# EAGLE schematic Yocto v2.007 (EAGLE 6.1), part 1 of 3

## Sheet 1 of 18: SEQ
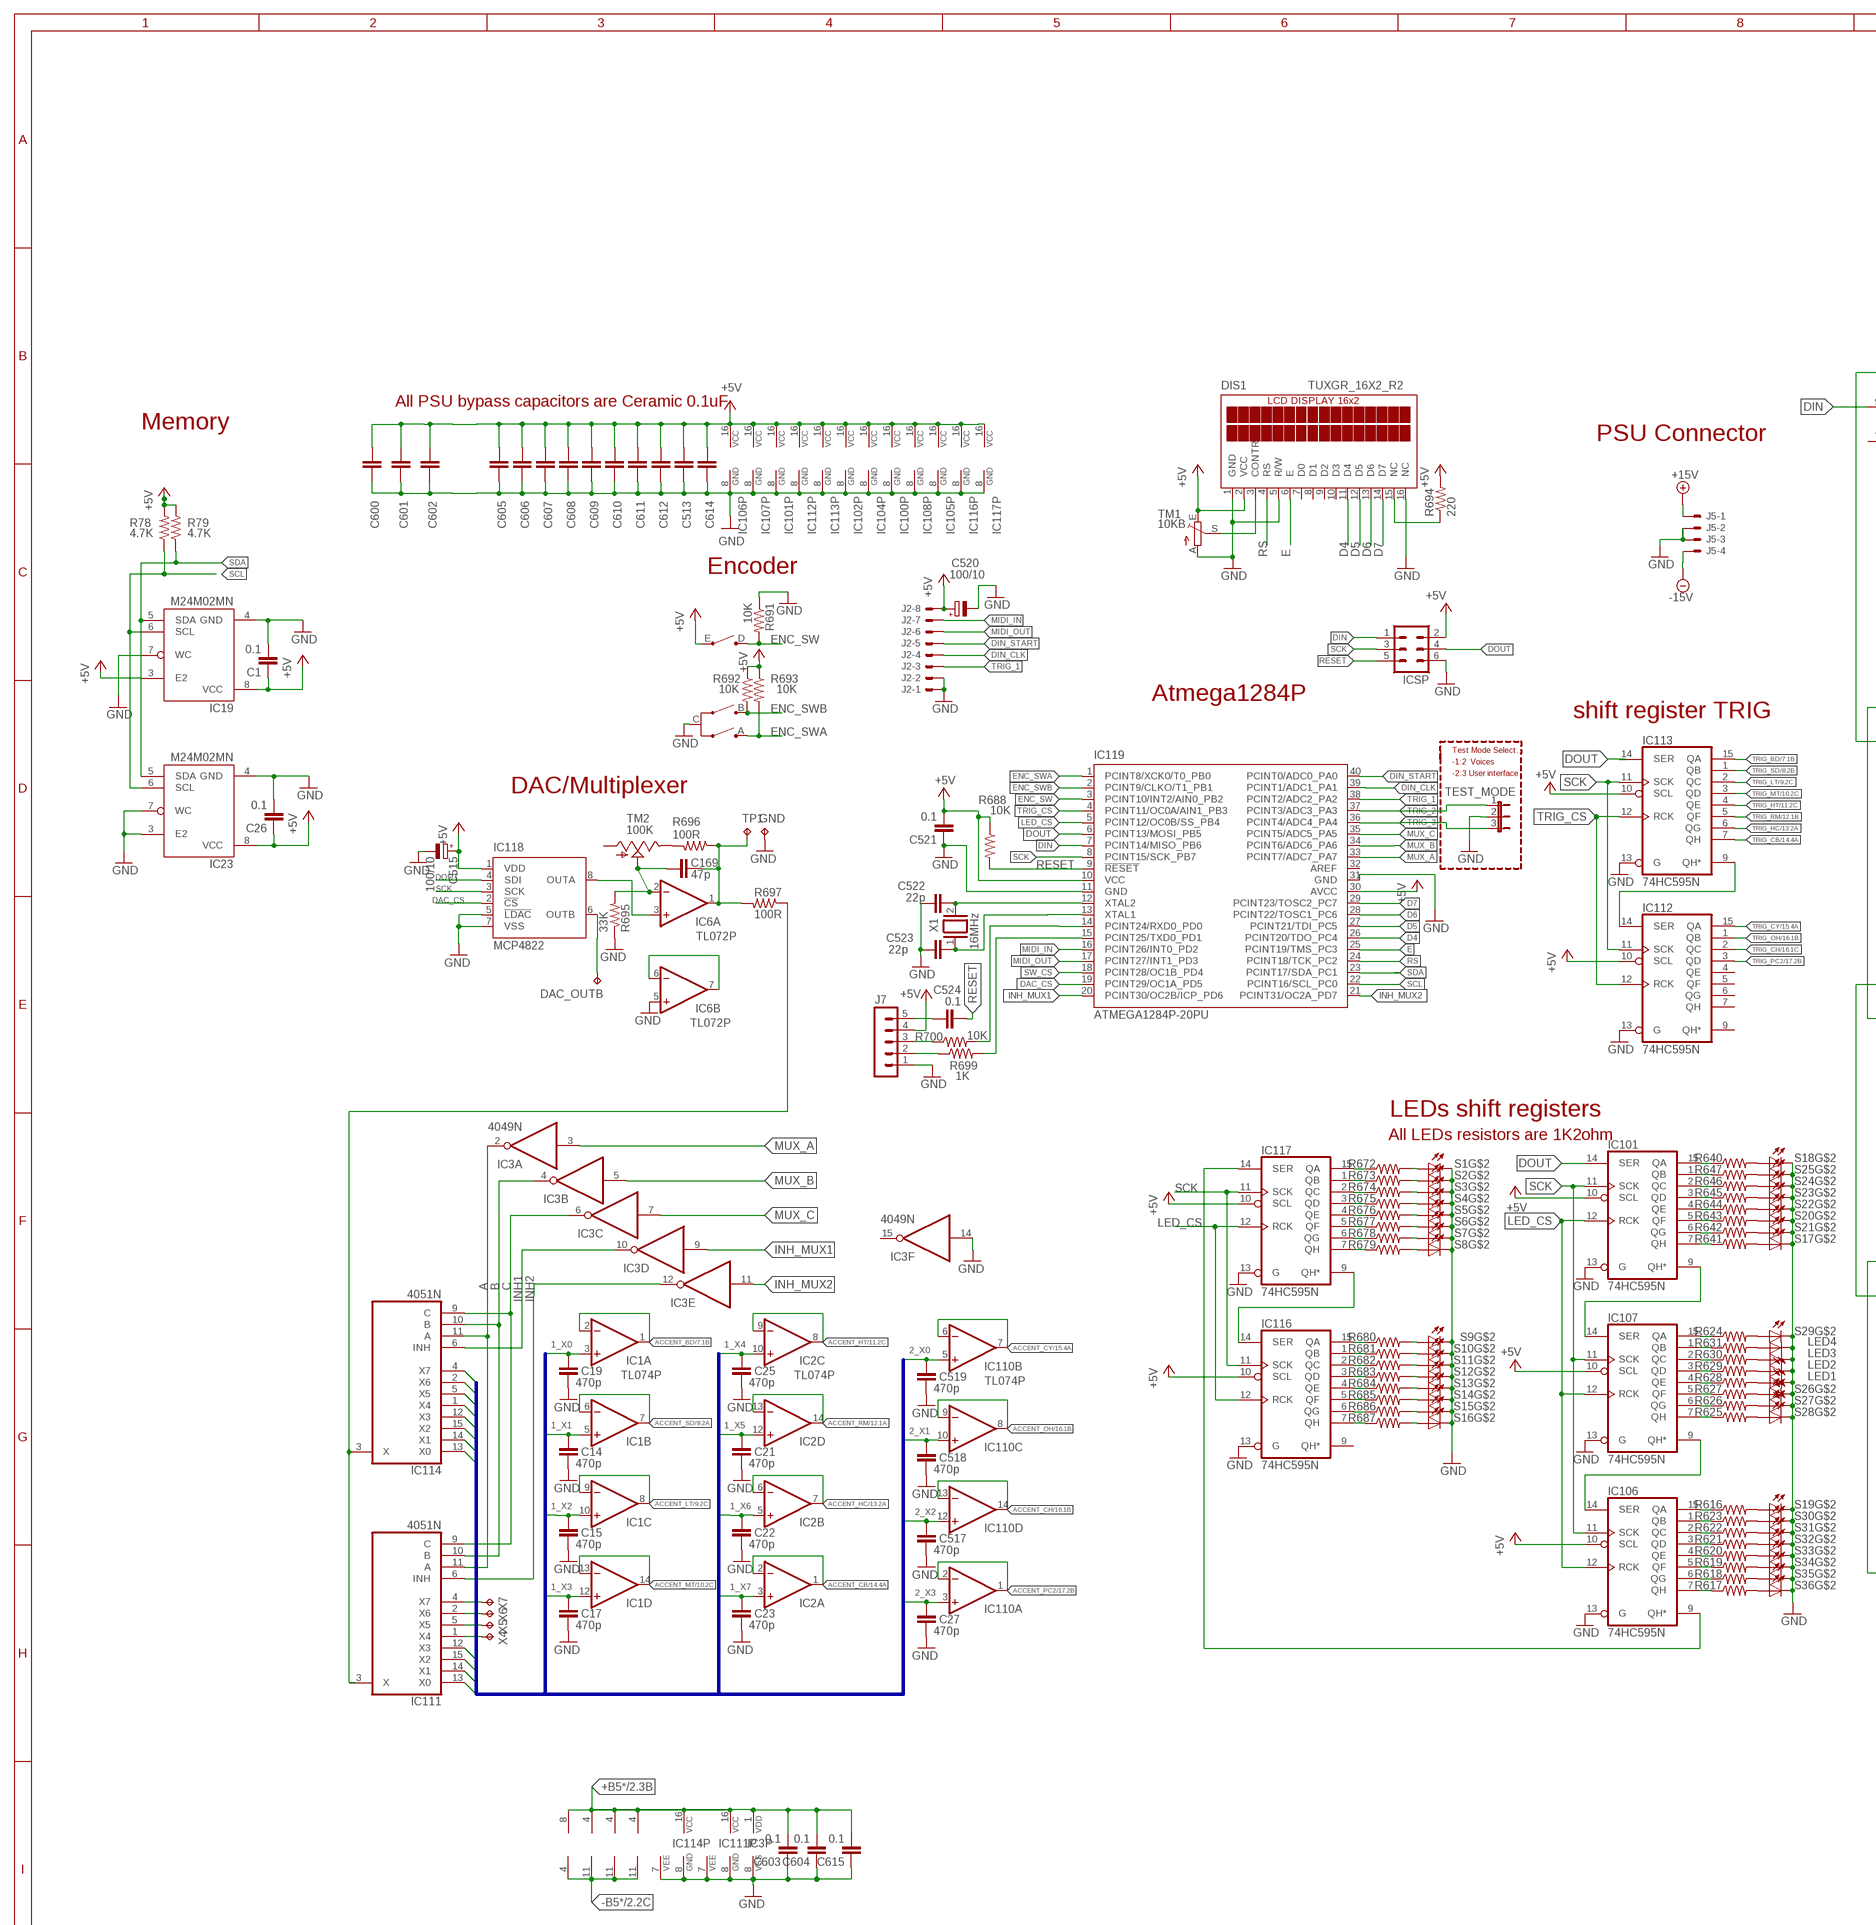
[diagram p0: schematic, sheet 1, part 1 of 2]
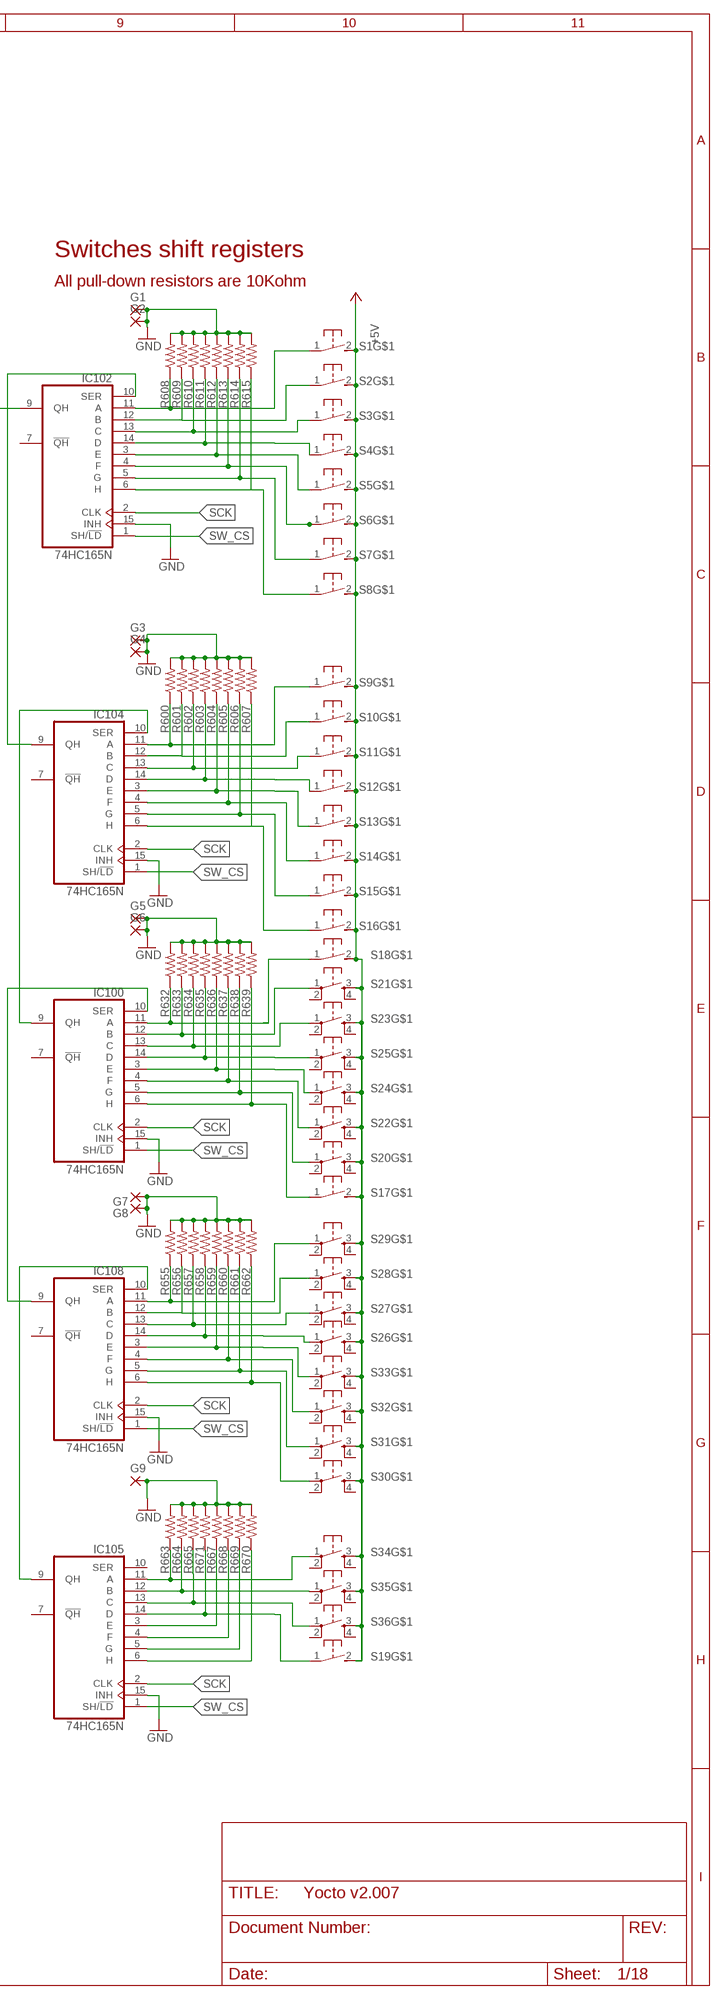
[diagram p1: schematic, sheet 1, part 2 of 2]

### Parts
C1  0.1  C-EU050-024X044  [C050-024X044]
C14  470p  C-EU050-025X075  [C050-025X075]
C15  470p  C-EU050-025X075  [C050-025X075]
C17  470p  C-EU050-025X075  [C050-025X075]
C19  470p  C-EU050-025X075  [C050-025X075]
C21  470p  C-EU050-025X075  [C050-025X075]
C22  470p  C-EU050-025X075  [C050-025X075]
C23  470p  C-EU050-025X075  [C050-025X075]
C25  470p  C-EU050-025X075  [C050-025X075]
C26  0.1  C-EU050-024X044  [C050-024X044]
C27  470p  C-EU050-025X075  [C050-025X075]
C169  47p  C-EU025-025X050  [C025-025X050]
C513  0.1  C-EU050-024X044  [C050-024X044]
C515  100/10  CPOL-EUE2-5  [E2-5]
C517  470p  C-EU050-025X075  [C050-025X075]
C518  470p  C-EU050-025X075  [C050-025X075]
C519  470p  C-EU050-025X075  [C050-025X075]
C520  100/10  CPOL-EUE2-5  [E2-5]
C521  0.1  C-EU050-024X044  [C050-024X044]
C522  22p  C-EU025-025X050  [C025-025X050]
C523  22p  C-EU025-025X050  [C025-025X050]
C524  0.1  C-EU050-024X044  [C050-024X044]
C600  0.1  C-EU050-024X044  [C050-024X044]
C601  0.1  C-EU050-024X044  [C050-024X044]
C602  0.1  C-EU050-024X044  [C050-024X044]
C603  0.1  C-EU050-024X044  [C050-024X044]
C604  0.1  C-EU050-024X044  [C050-024X044]
C605  0.1  C-EU050-024X044  [C050-024X044]
C606  0.1  C-EU050-024X044  [C050-024X044]
C607  0.1  C-EU050-024X044  [C050-024X044]
C608  0.1  C-EU050-024X044  [C050-024X044]
C609  0.1  C-EU050-024X044  [C050-024X044]
C610  0.1  C-EU050-024X044  [C050-024X044]
C611  0.1  C-EU050-024X044  [C050-024X044]
C612  0.1  C-EU050-024X044  [C050-024X044]
C614  0.1  C-EU050-024X044  [C050-024X044]
C615  0.1  C-EU050-024X044  [C050-024X044]
DAC_OUTB  TPB0,8  [B0,8]
DIS1  TUXGR_16X2_R2  [TUXGR_16X2_R2]
G1  WIREPAD1,6/0,8  [1,6/0,8]
G2  WIREPAD1,6/0,8  [1,6/0,8]
G3  WIREPAD1,6/0,8  [1,6/0,8]
G4  WIREPAD1,6/0,8  [1,6/0,8]
G5  WIREPAD1,6/0,8  [1,6/0,8]
G6  WIREPAD1,6/0,8  [1,6/0,8]
G7  WIREPAD1,6/0,8  [1,6/0,8]
G8  WIREPAD1,6/0,8  [1,6/0,8]
G9  WIREPAD1,6/0,8  [1,6/0,8]
GND  TPB0,8  [B0,8]
IC1  TL074P  [DIL14]
IC2  TL074P  [DIL14]
IC3  4049N  [DIL16]
IC6  TL072P  [DIL08]
IC19  M24M02MN  [SO08]
IC23  M24M02MN  [SO08]
IC100  74HC165N  [DIL16]
IC101  74HC595N  [DIL16]
IC102  74HC165N  [DIL16]
IC104  74HC165N  [DIL16]
IC105  74HC165N  [DIL16]
IC106  74HC595N  [DIL16]
IC107  74HC595N  [DIL16]
IC108  74HC165N  [DIL16]
IC110  TL074P  [DIL14]
IC111  4051N  [DIL16]
IC112  74HC595N  [DIL16]
IC113  74HC595N  [DIL16]
IC114  4051N  [DIL16]
IC116  74HC595N  [DIL16]
IC117  74HC595N  [DIL16]
IC118  MCP4822  [DIL8]
IC119  ATMEGA1284P-20PU  ATMEGA644-20PU  [DIL40]
ICSP  MA03-2  [MA03-2]
J2  22-27-2081-08  [6410-08]
J5  KK-156-4  [KK-156-4]
J7  MA05-1  [MA05-1A]
LED1  LED3MM  [LED3MM]
LED2  LED3MM  [LED3MM]
LED3  LED3MM  [LED3MM]
LED4  LED3MM  [LED3MM]
R78  4.7K  R-US_0207/7  [0207/7]
R79  4.7K  R-US_0207/7  [0207/7]
R600  10K  R-US_0207/7  [0207/7]
R601  10K  R-US_0207/7  [0207/7]
R602  10K  R-US_0207/7  [0207/7]
R603  10K  R-US_0207/7  [0207/7]
R604  10K  R-US_0207/7  [0207/7]
R605  10K  R-US_0207/7  [0207/7]
R606  10K  R-US_0207/7  [0207/7]
R607  10K  R-US_0207/7  [0207/7]
R608  10K  R-US_0207/7  [0207/7]
R609  10K  R-US_0207/7  [0207/7]
R610  10K  R-US_0207/7  [0207/7]
R611  10K  R-US_0207/7  [0207/7]
R612  10K  R-US_0207/7  [0207/7]
R613  10K  R-US_0207/7  [0207/7]
R614  10K  R-US_0207/7  [0207/7]
R615  10K  R-US_0207/7  [0207/7]
R616  1.2K  R-US_0207/7  [0207/7]
R617  1.2K  R-US_0207/7  [0207/7]
R618  1.2K  R-US_0207/7  [0207/7]
R619  1.2K  R-US_0207/7  [0207/7]
R620  1.2K  R-US_0207/7  [0207/7]
R621  1.2K  R-US_0207/7  [0207/7]
R622  1.2K  R-US_0207/7  [0207/7]
R623  1.2K  R-US_0207/7  [0207/7]
R624  1.2K  R-US_0207/7  [0207/7]
R625  1.2K  R-US_0207/7  [0207/7]
R626  1.2K  R-US_0207/7  [0207/7]
R627  1.2K  R-US_0207/7  [0207/7]
R628  1.2K  R-US_0207/7  [0207/7]
R629  1.2K  R-US_0207/7  [0207/7]
R630  1.2K  R-US_0207/7  [0207/7]
R631  1.2K  R-US_0207/7  [0207/7]
R632  10K  R-US_0207/7  [0207/7]
R633  10K  R-US_0207/7  [0207/7]
R634  10K  R-US_0207/7  [0207/7]
R635  10K  R-US_0207/7  [0207/7]
R636  10K  R-US_0207/7  [0207/7]
R637  10K  R-US_0207/7  [0207/7]
R638  10K  R-US_0207/7  [0207/7]
R639  10K  R-US_0207/7  [0207/7]
R640  1.2K  R-US_0207/7  [0207/7]
R641  1.2K  R-US_0207/7  [0207/7]
R642  1.2K  R-US_0207/7  [0207/7]
R643  1.2K  R-US_0207/7  [0207/7]
R644  1.2K  R-US_0207/7  [0207/7]
R645  1.2K  R-US_0207/7  [0207/7]
R646  1.2K  R-US_0207/7  [0207/7]
R647  1.2K  R-US_0207/7  [0207/7]
R655  10K  R-US_0207/7  [0207/7]
R656  10K  R-US_0207/7  [0207/7]
R657  10K  R-US_0207/7  [0207/7]
R658  10K  R-US_0207/7  [0207/7]
R659  10K  R-US_0207/7  [0207/7]
R660  10K  R-US_0207/7  [0207/7]
R661  10K  R-US_0207/7  [0207/7]
R662  10K  R-US_0207/7  [0207/7]
R663  10K  R-US_0207/7  [0207/7]
R664  10K  R-US_0207/7  [0207/7]
R665  10K  R-US_0207/7  [0207/7]
R667  10K  R-US_0207/7  [0207/7]
R668  10K  R-US_0207/7  [0207/7]
R669  10K  R-US_0207/7  [0207/7]
R670  10K  R-US_0207/7  [0207/7]
R671  10K  R-US_0207/7  [0207/7]
R672  1.2K  R-US_0207/7  [0207/7]
R673  1.2K  R-US_0207/7  [0207/7]
R674  1.2K  R-US_0207/7  [0207/7]
R675  1.2K  R-US_0207/7  [0207/7]
R676  1.2K  R-US_0207/7  [0207/7]
R677  1.2K  R-US_0207/7  [0207/7]
R678  1.2K  R-US_0207/7  [0207/7]
R679  1.2K  R-US_0207/7  [0207/7]
R680  1.2K  R-US_0207/7  [0207/7]
R681  1.2K  R-US_0207/7  [0207/7]
R682  1.2K  R-US_0207/7  [0207/7]
R683  1.2K  R-US_0207/7  [0207/7]
R684  1.2K  R-US_0207/7  [0207/7]
R685  1.2K  R-US_0207/7  [0207/7]
R686  1.2K  R-US_0207/7  [0207/7]
R687  1.2K  R-US_0207/7  [0207/7]
R688  10K  R-US_0207/7  [0207/7]
R691  10K  R-US_0207/7  [0207/7]
R692  10K  R-US_0207/7  [0207/7]
R693  10K  R-US_0207/7  [0207/7]
R694  220  R-US_0207/7  [0207/7]
R695  33K  R-US_0207/7  [0207/7]
R696  100R  R-US_0207/7  [0207/7]
R697  100R  R-US_0207/7  [0207/7]
R699  1K  R-US_0207/7  [0207/7]
R700  10K  R-US_0207/7  [0207/7]
S1  MX1A_CHERRY_SW_LED"  [MX1A-SW]
S2  MX1A_CHERRY_SW_LED"  [MX1A-SW]
S3  MX1A_CHERRY_SW_LED"  [MX1A-SW]
S4  MX1A_CHERRY_SW_LED"  [MX1A-SW]
S5  MX1A_CHERRY_SW_LED"  [MX1A-SW]
S6  MX1A_CHERRY_SW_LED"  [MX1A-SW]
S7  MX1A_CHERRY_SW_LED"  [MX1A-SW]
S8  MX1A_CHERRY_SW_LED"  [MX1A-SW]
S9  MX1A_CHERRY_SW_LED"  [MX1A-SW]
S10  MX1A_CHERRY_SW_LED"  [MX1A-SW]
S11  MX1A_CHERRY_SW_LED"  [MX1A-SW]
S12  MX1A_CHERRY_SW_LED"  [MX1A-SW]
S13  MX1A_CHERRY_SW_LED"  [MX1A-SW]
S14  MX1A_CHERRY_SW_LED"  [MX1A-SW]
S15  MX1A_CHERRY_SW_LED"  [MX1A-SW]
S16  MX1A_CHERRY_SW_LED"  [MX1A-SW]
S17  MX1A_CHERRY_SW_LED"  [MX1A-SW]
S18  MX1A_CHERRY_SW_LED"  [MX1A-SW]
S19  MX1A_CHERRY_SW_LED"  [MX1A-SW]
S20  ZTSN_SW_LED"  [SPH_SW]
S21  ZTSN_SW_LED"  [SPH_SW]
S22  ZTSN_SW_LED"  [SPH_SW]
S23  ZTSN_SW_LED"  [SPH_SW]
S24  ZTSN_SW_LED"  [SPH_SW]
S25  ZTSN_SW_LED"  [SPH_SW]
S26  ZTSN_SW_LED"  [SPH_SW]
S27  ZTSN_SW_LED"  [SPH_SW]
S28  ZTSN_SW_LED"  [SPH_SW]
S29  ZTSN_SW_LED"  [SPH_SW]
S30  ZTSN_SW_LED"  [SPH_SW]
S31  ZTSN_SW_LED"  [SPH_SW]
S32  ZTSN_SW_LED"  [SPH_SW]
S33  ZTSN_SW_LED"  [SPH_SW]
S34  ZTSN_SW_LED"  [SPH_SW]
S35  ZTSN_SW_LED"  [SPH_SW]
S36  ZTSN_SW_LED"  [SPH_SW]
TEST_MODE  JP2E  [JP2]
TM1  10KB  TRIM_EU-CT6  [CT6]
TM2  100K  TRIM_US-S64W  [S64W]
TP1  TPB0,8  [B0,8]
VR29  PEC16_ENCODER  [PEC16_ENCODER]
X1  16MHz  XTAL/S  [QS]
X4  TPB0,8  [B0,8]
X5  TPB0,8  [B0,8]
X6  TPB0,8  [B0,8]
X7  TPB0,8  [B0,8]

### Nets
1_X0 [special]: C19.1 IC1.3(A:+IN) IC114.13(X0)
1_X1 [special]: C14.1 IC1.5(B:+IN) IC114.14(X1)
1_X2 [special]: C15.1 IC1.10(C:+IN) IC114.15(X2)
1_X3 [special]: C17.1 IC1.12(D:+IN) IC114.12(X3)
1_X4 [special]: C25.1 IC2.10(C:+IN) IC114.1(X4)
1_X5 [special]: C21.1 IC2.12(D:+IN) IC114.5(X5)
1_X6 [special]: C22.1 IC2.5(B:+IN) IC114.2(X6)
1_X7 [special]: C23.1 IC2.3(A:+IN) IC114.4(X7)
2_X0: C519.1 IC110.5(B:+IN) IC111.13(X0)
2_X1: C518.1 IC110.10(C:+IN) IC111.14(X1)
2_X2: C517.1 IC110.12(D:+IN) IC111.15(X2)
2_X3: C27.1 IC110.3(A:+IN) IC111.12(X3)
+5V [power]: C1.1 C26.1 C513.2 C515.+ C520.+ C521.2 C600.2 C601.2 C602.2 C605.2 C606.2 C607.2 C608.2 C609.2 C610.2 C611.2 C612.2 C614.2 DIS1.2(VCC) IC19.3(E2) IC19.8(VCC) IC23.8(VCC) IC100.16(VCC) IC101.10(SCL) IC101.16(VCC) IC102.16(VCC) IC104.16(VCC) IC105.16(VCC) IC106.10(SCL) IC106.16(VCC) IC107.10(SCL) IC107.16(VCC) IC108.16(VCC) IC112.10(SCL) IC112.16(VCC) IC113.10(SCL) IC113.16(VCC) IC116.10(SCL) IC116.16(VCC) IC117.10(SCL) IC117.16(VCC) IC118.1(VDD) IC119.10(VCC) IC119.30(AVCC) ICSP.2 J2.8 J7.4 R78.2 R79.2 R688.1 R692.1 R693.1 R694.2 S1.2(S) S2.2(S) S3.2(S) S4.2(S) S5.2(S) S6.2(S) S7.2(S) S8.2(S) S9.2(S) S10.2(S) S11.2(S) S12.2(S) S13.2(S) S14.2(S) S15.2(S) S16.2(S) S17.2(S) S18.2(S) S19.2(S) S20.3(S) S21.3(S) S22.3(S) S23.3(S) S24.3(S) S25.3(S) S26.3(S) S27.3(S) S28.3(S) S29.3(S) S30.3(S) S31.3(S) S32.3(S) S33.3(S) S34.3(S) S35.3(S) S36.3(S) TM1.E VR29.E ; also sheet 3,4,5
+15V [power]: J5.1 ; also sheet 4,18
+B5* [power]: C603.2 C604.2 C615.2 IC1.4(P:V+) IC2.4(P:V+) IC3.1(P:VDD) IC6.8(P:V+) IC110.4(P:V+) IC111.16(VCC) IC114.16(VCC) ; also sheet 2,4
-15V [power]: J5.4 ; also sheet 4,18
-B5* [power]: IC1.11(P:V-) IC2.11(P:V-) IC6.4(P:V-) IC110.11(P:V-) ; also sheet 2,4
A [special]: IC3.2(A:O) IC111.11(A) IC114.11(A)
ACCENT_BD: IC1.1(A:OUT) IC1.2(A:-IN) ; also sheet 7
ACCENT_CB: IC2.1(A:OUT) IC2.2(A:-IN) ; also sheet 14
ACCENT_CH: IC110.13(D:-IN) IC110.14(D:OUT) ; also sheet 16
ACCENT_CY: IC110.6(B:-IN) IC110.7(B:OUT) ; also sheet 15
ACCENT_HC: IC2.6(B:-IN) IC2.7(B:OUT) ; also sheet 13
ACCENT_HT: IC2.8(C:OUT) IC2.9(C:-IN) ; also sheet 11
ACCENT_LT: IC1.8(C:OUT) IC1.9(C:-IN) ; also sheet 9
ACCENT_MT: IC1.13(D:-IN) IC1.14(D:OUT) ; also sheet 10
ACCENT_OH: IC110.8(C:OUT) IC110.9(C:-IN) ; also sheet 16
ACCENT_PC2: IC110.1(A:OUT) IC110.2(A:-IN) ; also sheet 17
ACCENT_RM: IC2.13(D:-IN) IC2.14(D:OUT) ; also sheet 12
ACCENT_SD: IC1.6(B:-IN) IC1.7(B:OUT) ; also sheet 8
B [special]: IC3.4(B:O) IC111.10(B) IC114.10(B)
C [special]: IC3.6(C:O) IC111.9(C) IC114.9(C)
D4 [special]: DIS1.11(D4) IC119.26(PCINT20/TDO_PC4)
D5 [special]: DIS1.12(D5) IC119.27(PCINT21/TDI_PC5)
D6 [special]: DIS1.13(D6) IC119.28(PCINT22/TOSC1_PC6)
D7 [special]: DIS1.14(D7) IC119.29(PCINT23/TOSC2_PC7)
DAC_CS [special]: IC118.2(!CS!) IC119.19(PCINT29/OC1A_PD5)
DIN [special]: IC102.9(QH) IC119.7(PCINT14/MISO_PB6) ICSP.1
DIN_CLK [special]: IC119.39(PCINT1/ADC1_PA1) J2.4
DIN_START [special]: IC119.40(PCINT0/ADC0_PA0) J2.5
DOUT [special]: IC101.14(SER) IC113.14(SER) IC118.4(SDI) IC119.6(PCINT13/MOSI_PB5) ICSP.4
E [special]: DIS1.6(E) IC119.25(PCINT19/TMS_PC3)
ENC_SW [special]: IC119.3(PCINT10/INT2/AIN0_PB2) R691.2 VR29.D
ENC_SWA [special]: IC119.1(PCINT8/XCK0/T0_PB0) R693.2 VR29.A
ENC_SWB [special]: IC119.2(PCINT9/CLKO/T1_PB1) R692.2 VR29.B
GND [GND]: C1.2 C14.2 C15.2 C17.2 C19.2 C21.2 C22.2 C23.2 C25.2 C26.2 C27.2 C513.1 C515.- C517.2 C518.2 C519.2 C520.- C521.1 C522.1 C523.1 C600.1 C601.1 C602.1 C603.1 C604.1 C605.1 C606.1 C607.1 C608.1 C609.1 C610.1 C611.1 C612.1 C614.1 C615.1 DIS1.1(GND) DIS1.5(R/W) DIS1.16(NC) G1.1(P) G2.1(P) G3.1(P) G4.1(P) G5.1(P) G6.1(P) G7.1(P) G8.1(P) G9.1(P) GND.P$1(TP) IC3.8(P:VSS) IC3.14(F:I) IC6.5(B:+IN) IC19.4(GND) IC19.7(WC) IC23.3(E2) IC23.4(GND) IC23.7(WC) IC100.8(GND) IC100.15(INH) IC101.8(GND) IC101.13(G) IC102.8(GND) IC102.15(INH) IC104.8(GND) IC104.15(INH) IC105.8(GND) IC105.15(INH) IC106.8(GND) IC106.13(G) IC107.8(GND) IC107.13(G) IC108.8(GND) IC108.15(INH) IC111.7(VEE) IC111.8(GND) IC112.8(GND) IC112.13(G) IC113.8(GND) IC113.13(G) IC114.7(VEE) IC114.8(GND) IC116.8(GND) IC116.13(G) IC117.8(GND) IC117.13(G) IC118.5(!LDAC!) IC118.7(VSS) IC119.11(GND) IC119.31(GND) ICSP.6 J2.1 J2.2 J5.2 J5.3 J7.1 LED1.K(C) LED2.K(C) LED3.K(C) LED4.K(C) R600.2 R601.2 R602.2 R603.2 R604.2 R605.2 R606.2 R607.2 R608.2 R609.2 R610.2 R611.2 R612.2 R613.2 R614.2 R615.2 R632.2 R633.2 R634.2 R635.2 R636.2 R637.2 R638.2 R639.2 R655.2 R656.2 R657.2 R658.2 R659.2 R660.2 R661.2 R662.2 R663.2 R664.2 R665.2 R667.2 R668.2 R669.2 R670.2 R671.2 R691.1 R695.1 S1.K(C) S2.K(C) S3.K(C) S4.K(C) S5.K(C) S6.K(C) S7.K(C) S8.K(C) S9.K(C) S10.K(C) S11.K(C) S12.K(C) S13.K(C) S14.K(C) S15.K(C) S16.K(C) S17.K(C) S18.K(C) S19.K(C) S20.K(C) S21.K(C) S22.K(C) S23.K(C) S24.K(C) S25.K(C) S26.K(C) S27.K(C) S28.K(C) S29.K(C) S30.K(C) S31.K(C) S32.K(C) S33.K(C) S34.K(C) S35.K(C) S36.K(C) TEST_MODE.2 TM1.A VR29.C ; also sheet 2,3,4,5,6,7,8,9,10,11,12,13,14,15,16,17,18
INH1 [special]: IC3.10(D:O) IC114.6(INH)
INH2 [special]: IC3.12(E:O) IC111.6(INH)
INH_MUX1 [special]: IC3.9(D:I) IC119.20(PCINT30/OC2B/ICP_PD6)
INH_MUX2 [special]: IC3.11(E:I) IC119.21(PCINT31/OC2A_PD7)
LED_CS [special]: IC101.12(RCK) IC106.12(RCK) IC107.12(RCK) IC116.12(RCK) IC117.12(RCK) IC119.5(PCINT12/OC0B/SS_PB4)
MIDI_IN [special]: IC119.16(PCINT26/INT0_PD2) J2.7
MIDI_OUT [special]: IC119.17(PCINT27/INT1_PD3) J2.6
MUX_A [special]: IC3.3(A:I) IC119.33(PCINT7/ADC7_PA7)
MUX_B [special]: IC3.5(B:I) IC119.34(PCINT6/ADC6_PA6)
MUX_C [special]: IC3.7(C:I) IC119.35(PCINT5/ADC5_PA5)
N$1 [special]: R624.2 S29.A
N$2 [special]: R625.2 S28.A
N$3 [special]: R626.2 S27.A
N$4 [special]: R627.2 S26.A
N$5 [special]: R647.2 S25.A
N$6 [special]: R646.2 S24.A
N$7 [special]: R645.2 S23.A
N$8 [special]: R644.2 S22.A
N$9 [special]: R642.2 S21.A
N$10 [special]: R643.2 S20.A
N$11 [special]: R640.2 S18.A
N$12 [special]: R641.2 S17.A
N$13 [special]: LED4.A R631.2
N$14 [special]: LED3.A R630.2
N$15 [special]: LED2.A R629.2
N$16 [special]: LED1.A R628.2
N$17 [special]: R616.2 S19.A
N$18 [special]: R617.2 S36.A
N$19 [special]: R618.2 S35.A
N$20 [special]: R619.2 S34.A
N$21 [special]: R620.2 S33.A
N$22 [special]: R621.2 S32.A
N$23 [special]: R622.2 S31.A
N$24 [special]: R623.2 S30.A
N$163 [special]: IC108.14(D) R658.1 S26.1(P)
N$164: IC6.3(A:+IN) IC118.8(OUTA)
N$166 [special]: IC117.15(QA) R672.1
N$222 [special]: IC117.1(QB) R673.1
N$231 [special]: IC117.2(QC) R674.1
N$233 [special]: IC117.3(QD) R675.1
N$236 [special]: IC117.4(QE) R676.1
N$237 [special]: IC117.5(QF) R677.1
N$238 [special]: IC117.6(QG) R678.1
N$239 [special]: IC117.7(QH) R679.1
N$241 [special]: IC116.14(SER) IC117.9(QH*)
N$242 [special]: IC116.15(QA) R680.1
N$243 [special]: IC116.1(QB) R681.1
N$244 [special]: IC116.2(QC) R682.1
N$245 [special]: IC116.3(QD) R683.1
N$246 [special]: IC116.4(QE) R684.1
N$247 [special]: IC116.5(QF) R685.1
N$248 [special]: IC116.6(QG) R686.1
N$249 [special]: IC116.7(QH) R687.1
N$250 [special]: R680.2 S9.A
N$251 [special]: R681.2 S10.A
N$252 [special]: R682.2 S11.A
N$253 [special]: R683.2 S12.A
N$254 [special]: R684.2 S13.A
N$255 [special]: R685.2 S14.A
N$256 [special]: R686.2 S15.A
N$257 [special]: R687.2 S16.A
N$258 [special]: R672.2 S1.A
N$259 [special]: R673.2 S2.A
N$260 [special]: R674.2 S3.A
N$261 [special]: R675.2 S4.A
N$262 [special]: R676.2 S5.A
N$263 [special]: R677.2 S6.A
N$264 [special]: R678.2 S7.A
N$265 [special]: R679.2 S8.A
N$266 [special]: IC106.9(QH*) IC117.14(SER)
N$268: IC6.6(B:-IN) IC6.7(B:OUT)
N$272 [special]: IC119.15(PCINT25/TXD0_PD1) R699.2
N$273 [special]: IC119.14(PCINT24/RXD0_PD0) R700.2
N$367 [special]: IC112.14(SER) IC113.9(QH*)
N$377 [special]: C522.2 IC119.12(XTAL2) X1.2
N$378 [special]: C523.2 IC119.13(XTAL1) X1.1
N$429: IC111.1(X4) X4.P$1(TP)
N$431: IC111.5(X5) X5.P$1(TP)
N$432: IC111.2(X6) X6.P$1(TP)
N$433: IC111.4(X7) X7.P$1(TP)
N$587 [special]: IC102.11(A) R608.1 S1.1(P)
N$592 [special]: IC102.12(B) R609.1 S2.1(P)
N$593 [special]: IC102.13(C) R610.1 S3.1(P)
N$594 [special]: IC102.14(D) R611.1 S4.1(P)
N$595 [special]: IC102.3(E) R612.1 S5.1(P)
N$596 [special]: IC102.4(F) R613.1 S6.1(P)
N$597 [special]: IC102.5(G) R614.1 S7.1(P)
N$598 [special]: IC102.6(H) R615.1 S8.1(P)
N$599 [special]: IC104.11(A) R600.1 S9.1(P)
N$600 [special]: IC104.12(B) R601.1 S10.1(P)
N$601 [special]: IC104.13(C) R602.1 S11.1(P)
N$602 [special]: IC104.14(D) R603.1 S12.1(P)
N$603 [special]: IC104.3(E) R604.1 S13.1(P)
N$604 [special]: IC104.4(F) R605.1 S14.1(P)
N$605 [special]: IC104.5(G) R606.1 S15.1(P)
N$606 [special]: IC104.6(H) R607.1 S16.1(P)
N$607 [special]: IC100.11(A) R632.1 S18.1(P)
N$608 [special]: IC100.12(B) R633.1 S21.1(P)
N$609 [special]: IC100.13(C) R634.1 S23.1(P)
N$610 [special]: IC100.14(D) R635.1 S25.1(P)
N$611 [special]: IC100.3(E) R636.1 S24.1(P)
N$612 [special]: IC100.4(F) R637.1 S22.1(P)
N$613 [special]: IC100.5(G) R638.1 S20.1(P)
N$614 [special]: IC102.10(SER) IC104.9(QH)
N$615 [special]: IC100.9(QH) IC104.10(SER)
N$633 [special]: IC100.6(H) R639.1 S17.1(P)
N$634 [special]: IC111.3(X) IC114.3(X) R697.1
N$639 [special]: IC101.15(QA) R640.1
N$640 [special]: IC100.10(SER) IC108.9(QH)
N$641 [special]: IC108.11(A) R655.1 S29.1(P)
N$642 [special]: IC108.12(B) R656.1 S28.1(P)
N$643 [special]: IC108.13(C) R657.1 S27.1(P)
N$645 [special]: IC108.3(E) R659.1 S33.1(P)
N$646 [special]: IC108.4(F) R660.1 S32.1(P)
N$647 [special]: IC108.5(G) R661.1 S31.1(P)
N$648 [special]: IC108.6(H) R662.1 S30.1(P)
N$649 [special]: IC101.1(QB) R647.1
N$650 [special]: IC105.9(QH) IC108.10(SER)
N$651 [special]: IC101.2(QC) R646.1
N$652 [special]: IC105.11(A) R663.1 S34.1(P)
N$653 [special]: IC105.12(B) R664.1 S35.1(P)
N$654 [special]: IC105.13(C) R665.1 S36.1(P)
N$655 [special]: IC105.14(D) R671.1 S19.1(P)
N$656 [special]: IC105.3(E) R667.1
N$657 [special]: IC105.4(F) R668.1
N$658 [special]: IC105.5(G) R669.1
N$659 [special]: IC105.6(H) R670.1
N$660 [special]: IC101.3(QD) R645.1
N$661 [special]: IC101.4(QE) R644.1
N$662 [special]: IC101.5(QF) R643.1
N$663 [special]: IC101.6(QG) R642.1
N$664 [special]: IC101.7(QH) R641.1
N$665 [special]: IC107.15(QA) R624.1
N$666 [special]: IC107.1(QB) R631.1
N$667 [special]: IC107.2(QC) R630.1
N$668 [special]: IC107.3(QD) R629.1
N$669 [special]: IC107.4(QE) R628.1
N$670 [special]: IC107.5(QF) R627.1
N$671 [special]: IC107.6(QG) R626.1
N$672 [special]: IC107.7(QH) R625.1
N$673 [special]: IC101.9(QH*) IC107.14(SER)
N$674 [special]: IC106.14(SER) IC107.9(QH*)
N$675 [special]: IC106.15(QA) R616.1
N$676 [special]: IC106.1(QB) R623.1
N$677 [special]: IC106.2(QC) R622.1
N$678 [special]: IC106.3(QD) R621.1
N$679 [special]: IC106.4(QE) R620.1
N$680 [special]: IC106.5(QF) R619.1
N$681 [special]: IC106.6(QG) R618.1
N$682 [special]: IC106.7(QH) R617.1
N$707: R696.2 TM2.E
N$708: C169.2 IC6.1(A:OUT) R696.1 R697.2 TP1.P$1(TP)
N$709: C169.1 IC6.2(A:-IN) R695.2 TM2.S
N$722 [special]: DIS1.15(NC) R694.1
N$723 [special]: DIS1.3(CONTR) TM1.S
N$771 [special]: C524.2 J7.5
N$786 [special]: J7.3 R700.1
N$787 [special]: J7.2 R699.1
RESET [special]: C524.1 IC119.9(!RESET) ICSP.5 R688.2
RS [special]: DIS1.4(RS) IC119.24(PCINT18/TCK_PC2)
SCK [special]: IC100.2(CLK) IC101.11(SCK) IC102.2(CLK) IC104.2(CLK) IC105.2(CLK) IC106.11(SCK) IC107.11(SCK) IC108.2(CLK) IC112.11(SCK) IC113.11(SCK) IC116.11(SCK) IC117.11(SCK) IC118.3(SCK) IC119.8(PCINT15/SCK_PB7) ICSP.3
SCL [special]: IC19.6(SCL) IC23.6(SCL) IC119.22(PCINT16/SCL_PC0) R78.1
SDA [special]: IC19.5(SDA) IC23.5(SDA) IC119.23(PCINT17/SDA_PC1) R79.1
SW_CS [special]: IC100.1(SH/!LD) IC102.1(SH/!LD) IC104.1(SH/!LD) IC105.1(SH/!LD) IC108.1(SH/!LD) IC119.18(PCINT28/OC1B_PD4)
TRIG_1 [special]: IC119.38(PCINT2/ADC2_PA2) J2.3
TRIG_2 [special]: IC119.37(PCINT3/ADC3_PA3) TEST_MODE.1
TRIG_3 [special]: IC119.36(PCINT4/ADC4_PA4) TEST_MODE.3
TRIG_BD: IC113.15(QA) ; also sheet 7
TRIG_CB: IC113.7(QH) ; also sheet 14
TRIG_CH: IC112.2(QC) ; also sheet 16
TRIG_CS [special]: IC112.12(RCK) IC113.12(RCK) IC119.4(PCINT11/OC0A/AIN1_PB3)
TRIG_CY: IC112.15(QA) ; also sheet 15
TRIG_HC: IC113.6(QG) ; also sheet 13
TRIG_HT: IC113.4(QE) ; also sheet 11
TRIG_LT: IC113.2(QC) ; also sheet 9
TRIG_MT: IC113.3(QD) ; also sheet 10
TRIG_OH: IC112.1(QB) ; also sheet 16
TRIG_PC2: IC112.3(QD) ; also sheet 17
TRIG_RM: IC113.5(QF) ; also sheet 12
TRIG_SD: IC113.1(QB) ; also sheet 8
WN1: DAC_OUTB.P$1(TP) IC118.6(OUTB)
Unconnected: DIS1.7(D0) DIS1.8(D1) DIS1.9(D2) DIS1.10(D3) IC3.15(F:O) IC100.7(!QH) IC102.7(!QH) IC104.7(!QH) IC105.7(!QH) IC105.10(SER) IC108.7(!QH) IC112.4(QE) IC112.5(QF) IC112.6(QG) IC112.7(QH) IC112.9(QH*) IC116.9(QH*) IC119.32(AREF) S20.2(P1) S20.4(S1) S21.2(P1) S21.4(S1) S22.2(P1) S22.4(S1) S23.2(P1) S23.4(S1) S24.2(P1) S24.4(S1) S25.2(P1) S25.4(S1) S26.2(P1) S26.4(S1) S27.2(P1) S27.4(S1) S28.2(P1) S28.4(S1) S29.2(P1) S29.4(S1) S30.2(P1) S30.4(S1) S31.2(P1) S31.4(S1) S32.2(P1) S32.4(S1) S33.2(P1) S33.4(S1) S34.2(P1) S34.4(S1) S35.2(P1) S35.4(S1) S36.2(P1) S36.4(S1) TM2.A

### Buses
B$1

### Notes on the sheet
- Switches shift registers
- All pull-down resistors are 10Kohm
- All PSU bypass capacitors are Ceramic 0.1uF
- Memory
- PSU Connector
- Encoder
- Atmega1284P
- shift register TRIG
- Test Mode Select:
- -1:2  Voices
- -2:3 User interface
- DAC/Multiplexer
- LEDs shift registers
- All LEDs resistors are 1K2ohm

## Sheet 2 of 18: Master
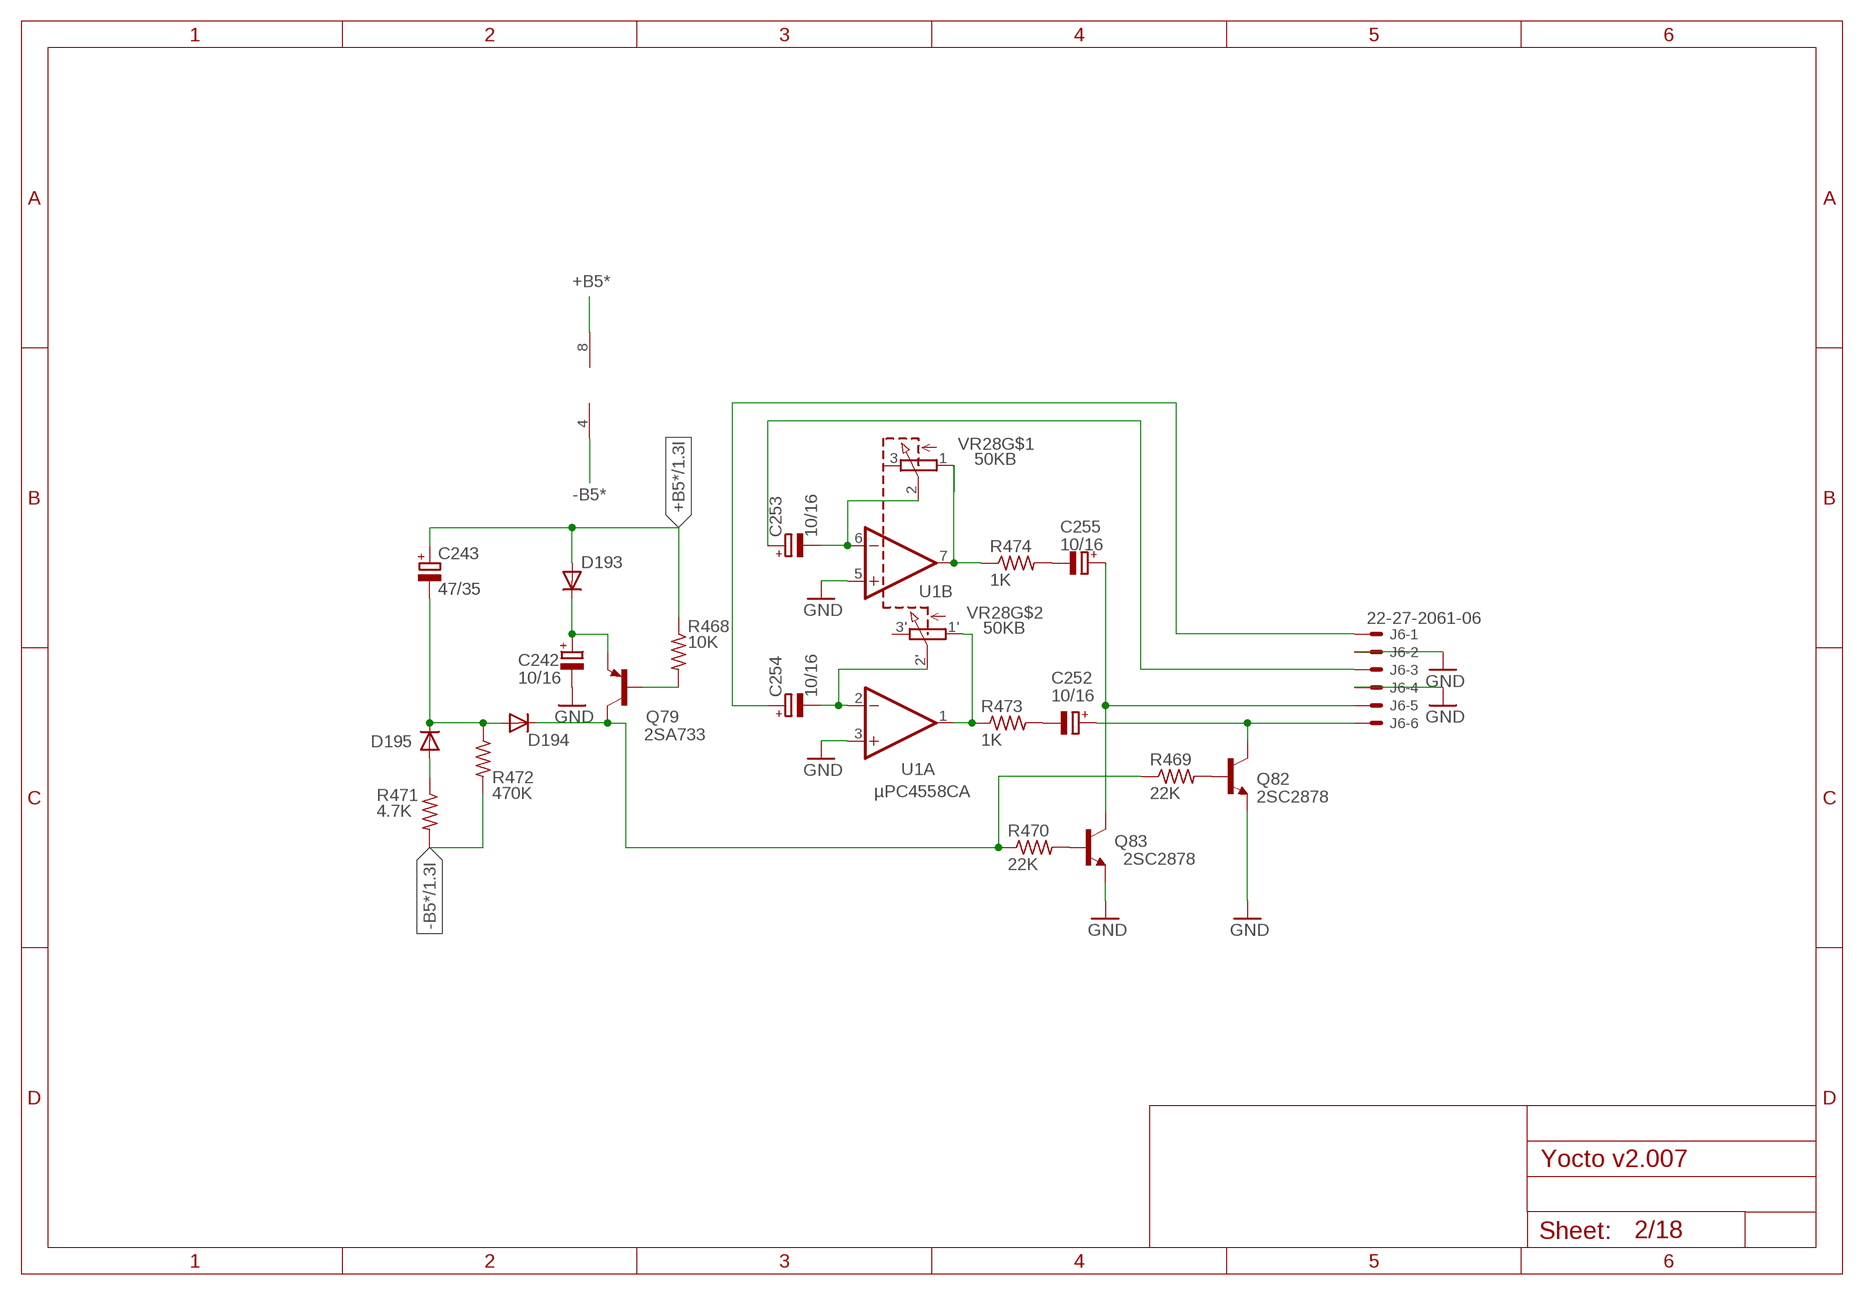
[diagram p2: schematic, sheet 2]

### Parts
C242  10/16  CPOL-EUE2-5  [E2-5]
C243  47/35  CPOL-EUE2.5-6  [E2,5-6]
C252  10/16  CPOL-EUE2-5  [E2-5]
C253  10/16  CPOL-EUE2-5  [E2-5]
C254  10/16  CPOL-EUE2-5  [E2-5]
C255  10/16  CPOL-EUE2-5  [E2-5]
D193  1N4148  [DO35-7C]
D194  1N4148  [DO35-7C]
D195  1N4148  [DO35-7C]
J6  22-27-2061-06  [6410-06]
Q79  2SA733  [TO-92-ECB-MARKED]
Q82  2SC2878  [TO92-ECB]
Q83  2SC2878  [TO92-ECB]
R468  10K  R-US_0207/7  [0207/7]
R469  22K  R-US_0207/7  [0207/7]
R470  22K  R-US_0207/7  [0207/7]
R471  4.7K  R-US_0207/7  [0207/7]
R472  470K  R-US_0207/7  [0207/7]
R473  1K  R-US_0207/7  [0207/7]
R474  1K  R-US_0207/7  [0207/7]
U1  µPC4558CA  [DIL08]
VR28  50KB  POT_DUAL  [PTV112-4]

### Nets
+B5* [power]: C243.+ D193.A R468.1 U1.8(V+) ; also sheet 1,4
-B5* [power]: R471.2 R472.2 U1.4(V-) ; also sheet 1,4
GND [GND]: C242.- J6.2 J6.4 Q82.E Q83.E U1.3(A:+IN) U1.5(B:+IN) ; also sheet 1,3,4,5,6,7,8,9,10,11,12,13,14,15,16,17,18
N$269: D195.A R471.1
N$274: C243.- D194.A D195.C R472.1
N$720: R474.1 U1.7(B:OUT) VR28.1
N$721: R473.1 U1.1(A:OUT) VR28.1'
N$770: D194.C Q79.C R469.1 R470.1
N$772: C242.+ D193.C Q79.E
N$773: Q79.B R468.2
N$774: C254.- U1.2(A:-IN) VR28.2'
N$775: C253.- U1.6(B:-IN) VR28.2
N$778: C255.- R474.2
N$779: C252.- R473.2
N$780: Q82.B R469.2
N$781: Q83.B R470.2
N$782: C253.+ J6.3
N$783: C255.+ J6.5 Q83.C
N$784: C252.+ J6.6 Q82.C
N$785: C254.+ J6.1
Unconnected: VR28.3 VR28.3'

## Sheet 3 of 18: PSU
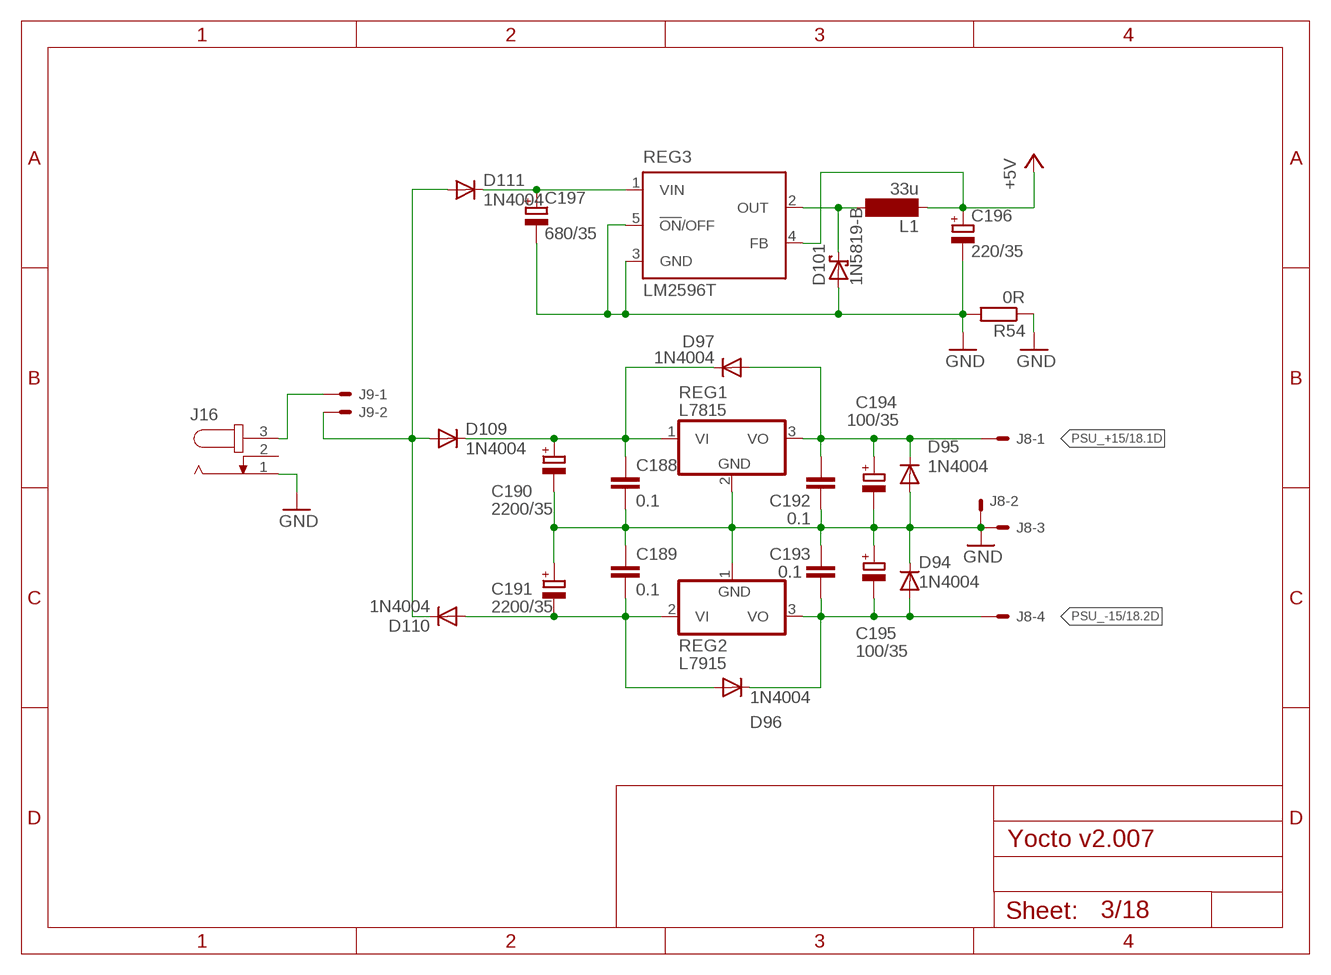
[diagram p3: schematic, sheet 3]

### Parts
C188  0.1  C-EU050-024X044  [C050-024X044]
C189  0.1  C-EU050-024X044  [C050-024X044]
C190  2200/35  CPOL-EUE7.5-16  [E7,5-16]
C191  2200/35  CPOL-EUE7.5-16  [E7,5-16]
C192  0.1  C-EU050-024X044  [C050-024X044]
C193  0.1  C-EU050-024X044  [C050-024X044]
C194  100/35  CPOL-EUE3.5-8  [E3,5-8]
C195  100/35  CPOL-EUE3.5-8  [E3,5-8]
C196  220/35  CPOL-EUE3.5-8  [E3,5-8]
C197  680/35  CPOL-EUE5-13  [E5-13]
D94  1N4004  [DO41-7]
D95  1N4004  [DO41-7]
D96  1N4004  [DO41-7]
D97  1N4004  [DO41-7]
D101  1N5819-B  [DO41-7.6]
D109  1N4004  [DO41-7]
D110  1N4004  [DO41-7]
D111  1N4004  [DO41-7]
J8  KK-156-4  [KK-156-4]
J9  KK-156-2  [KK-156-2]
J16  JACK-PLUG0  [JACK_PSU_2.1MM]
L1  33u  BS11  [BS11]
R54  0R  R-EU_0207/7  [0207/7]
REG1  L7815  7815TV  [TO220V]
REG2  L7915  MC79M15BT  [TO220V]
REG3  LM2596T  [T05D]

### Nets
+5V [power]: C196.+ L1.1 REG3.4(FB) ; also sheet 1,4,5
GND [GND]: C188.2 C189.1 C190.- C191.+ C192.2 C193.1 C194.- C195.+ C196.- C197.- D94.C D95.A D101.A J8.2 J8.3 J16.1 R54.1 R54.2 REG1.2(GND) REG2.1(GND) REG3.3(GND) REG3.5(!ON!/OFF) ; also sheet 1,2,4,5,6,7,8,9,10,11,12,13,14,15,16,17,18
N$270 [power]: C189.2 C191.- D96.A D110.A REG2.2(VI)
N$271 [power]: C188.1 C190.+ D97.C D109.C REG1.1(VI)
N$789 [power]: D109.A D110.C D111.A J9.2
N$791 [power]: C197.+ D111.C REG3.1(VIN)
N$792 [power]: D101.C L1.2 REG3.2(OUT)
N$830: J9.1 J16.3
PSU_+15: C192.1 C194.+ D95.C D97.A J8.1 REG1.3(VO) ; also sheet 18
PSU_-15 [power]: C193.2 C195.- D94.A D96.C J8.4 REG2.3(VO) ; also sheet 18
Unconnected: J16.2

## Sheet 4 of 18: PSU BUSS
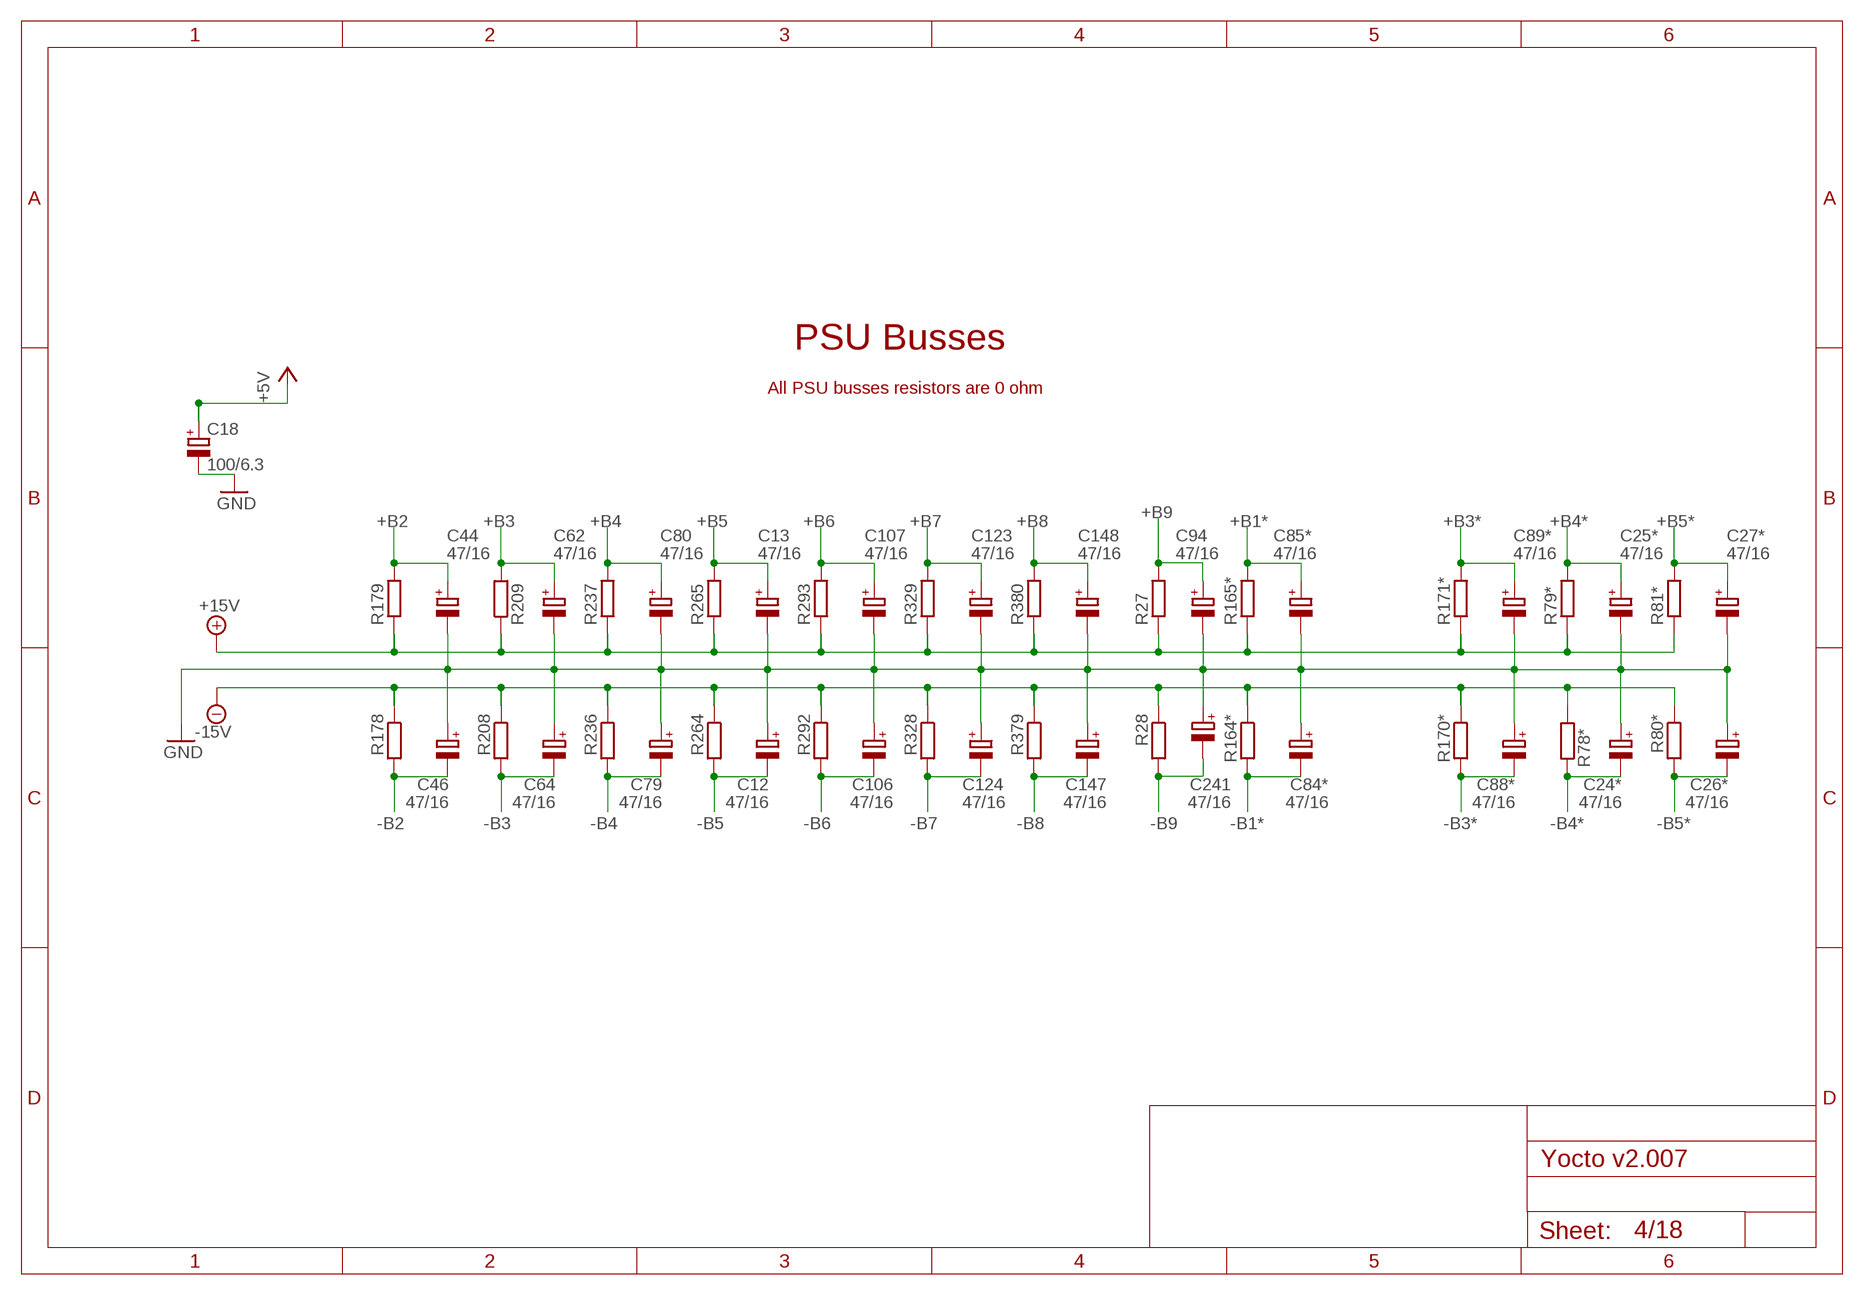
[diagram p4: schematic, sheet 4]

### Parts
C12  47/16  CPOL-EUE2.5-6  [E2,5-6]
C13  47/16  CPOL-EUE2.5-6  [E2,5-6]
C18  100/6.3  CPOL-EUE2-5  [E2-5]
C24*  47/16  CPOL-EUE2.5-6  [E2,5-6]
C25*  47/16  CPOL-EUE2.5-6  [E2,5-6]
C26*  47/16  CPOL-EUE2.5-6  [E2,5-6]
C27*  47/16  CPOL-EUE2.5-6  [E2,5-6]
C44  47/16  CPOL-EUE2.5-6  [E2,5-6]
C46  47/16  CPOL-EUE2.5-6  [E2,5-6]
C62  47/16  CPOL-EUE2.5-6  [E2,5-6]
C64  47/16  CPOL-EUE2.5-6  [E2,5-6]
C79  47/16  CPOL-EUE2.5-6  [E2,5-6]
C80  47/16  CPOL-EUE2.5-6  [E2,5-6]
C84*  47/16  CPOL-EUE2.5-6  [E2,5-6]
C85*  47/16  CPOL-EUE2.5-6  [E2,5-6]
C88*  47/16  CPOL-EUE2.5-6  [E2,5-6]
C89*  47/16  CPOL-EUE2.5-6  [E2,5-6]
C94  47/16  CPOL-EUE2.5-6  [E2,5-6]
C106  47/16  CPOL-EUE2.5-6  [E2,5-6]
C107  47/16  CPOL-EUE2.5-6  [E2,5-6]
C123  47/16  CPOL-EUE2.5-6  [E2,5-6]
C124  47/16  CPOL-EUE2.5-6  [E2,5-6]
C147  47/16  CPOL-EUE2.5-6  [E2,5-6]
C148  47/16  CPOL-EUE2.5-6  [E2,5-6]
C241  47/16  CPOL-EUE2.5-6  [E2,5-6]
R27  0R  R-EU_0207/7  [0207/7]
R28  0R  R-EU_0207/7  [0207/7]
R78*  0R  R-EU_0207/7  [0207/7]
R79*  0R  R-EU_0207/7  [0207/7]
R80*  0R  R-EU_0207/7  [0207/7]
R81*  0R  R-EU_0207/7  [0207/7]
R164*  0R  R-EU_0207/7  [0207/7]
R165*  0R  R-EU_0207/7  [0207/7]
R170*  0R  R-EU_0207/7  [0207/7]
R171*  0R  R-EU_0207/7  [0207/7]
R178  0R  R-EU_0207/7  [0207/7]
R179  0R  R-EU_0207/7  [0207/7]
R208  0R  R-EU_0207/7  [0207/7]
R209  0R  R-EU_0207/7  [0207/7]
R236  0R  R-EU_0207/7  [0207/7]
R237  0R  R-EU_0207/7  [0207/7]
R264  0R  R-EU_0207/7  [0207/7]
R265  0R  R-EU_0207/7  [0207/7]
R292  0R  R-EU_0207/7  [0207/7]
R293  0R  R-EU_0207/7  [0207/7]
R328  0R  R-EU_0207/7  [0207/7]
R329  0R  R-EU_0207/7  [0207/7]
R379  0R  R-EU_0207/7  [0207/7]
R380  0R  R-EU_0207/7  [0207/7]

### Nets
+5V [power]: C18.+ ; also sheet 1,3,5
+15V [power]: R27.1 R79*.1 R81*.1 R165*.1 R171*.1 R179.1 R209.1 R237.1 R265.1 R293.1 R329.1 R380.1 ; also sheet 1,18
+B1* [power]: C85*.+ R165*.2 ; also sheet 14,15
+B2 [power]: C44.+ R179.2 ; also sheet 7
+B3 [power]: C62.+ R209.2 ; also sheet 8,9
+B3* [power]: C89*.+ R171*.2 ; also sheet 16
+B4 [power]: C80.+ R237.2 ; also sheet 6,9
+B4* [power]: C25*.+ R79*.2 ; also sheet 15
+B5 [power]: C13.+ R265.2 ; also sheet 10
+B5* [power]: C27*.+ R81*.2 ; also sheet 1,2
+B6 [power]: C107.+ R293.2 ; also sheet 11
+B7 [power]: C123.+ R329.2 ; also sheet 12,13
+B8 [power]: C148.+ R380.2 ; also sheet 13
+B9 [power]: C94.+ R27.2 ; also sheet 17
-15V [power]: R28.1 R78*.2 R80*.1 R164*.1 R170*.1 R178.1 R208.1 R236.1 R264.1 R292.1 R328.1 R379.1 ; also sheet 1,18
-B1* [power]: C84*.- R164*.2 ; also sheet 14,15
-B2 [power]: C46.- R178.2 ; also sheet 7
-B3 [power]: C64.- R208.2 ; also sheet 8,9
-B3* [power]: C88*.- R170*.2 ; also sheet 16
-B4 [power]: C79.- R236.2 ; also sheet 6,9
-B4* [power]: C24*.- R78*.1 ; also sheet 15
-B5 [power]: C12.- R264.2 ; also sheet 10
-B5* [power]: C26*.- R80*.2 ; also sheet 1,2
-B6 [power]: C106.- R292.2 ; also sheet 11
-B7 [power]: C124.- R328.2 ; also sheet 12,13
-B8 [power]: C147.- R379.2 ; also sheet 13
-B9 [power]: C241.- R28.2 ; also sheet 17
GND [GND]: C12.+ C13.- C18.- C24*.+ C25*.- C26*.+ C27*.- C44.- C46.+ C62.- C64.+ C79.+ C80.- C84*.+ C85*.- C88*.+ C89*.- C94.- C106.+ C107.- C123.- C124.+ C147.+ C148.- C241.+ ; also sheet 1,2,3,5,6,7,8,9,10,11,12,13,14,15,16,17,18

### Notes on the sheet
- PSU Busses
- All PSU busses resistors are 0 ohm

## Sheet 5 of 18: IO
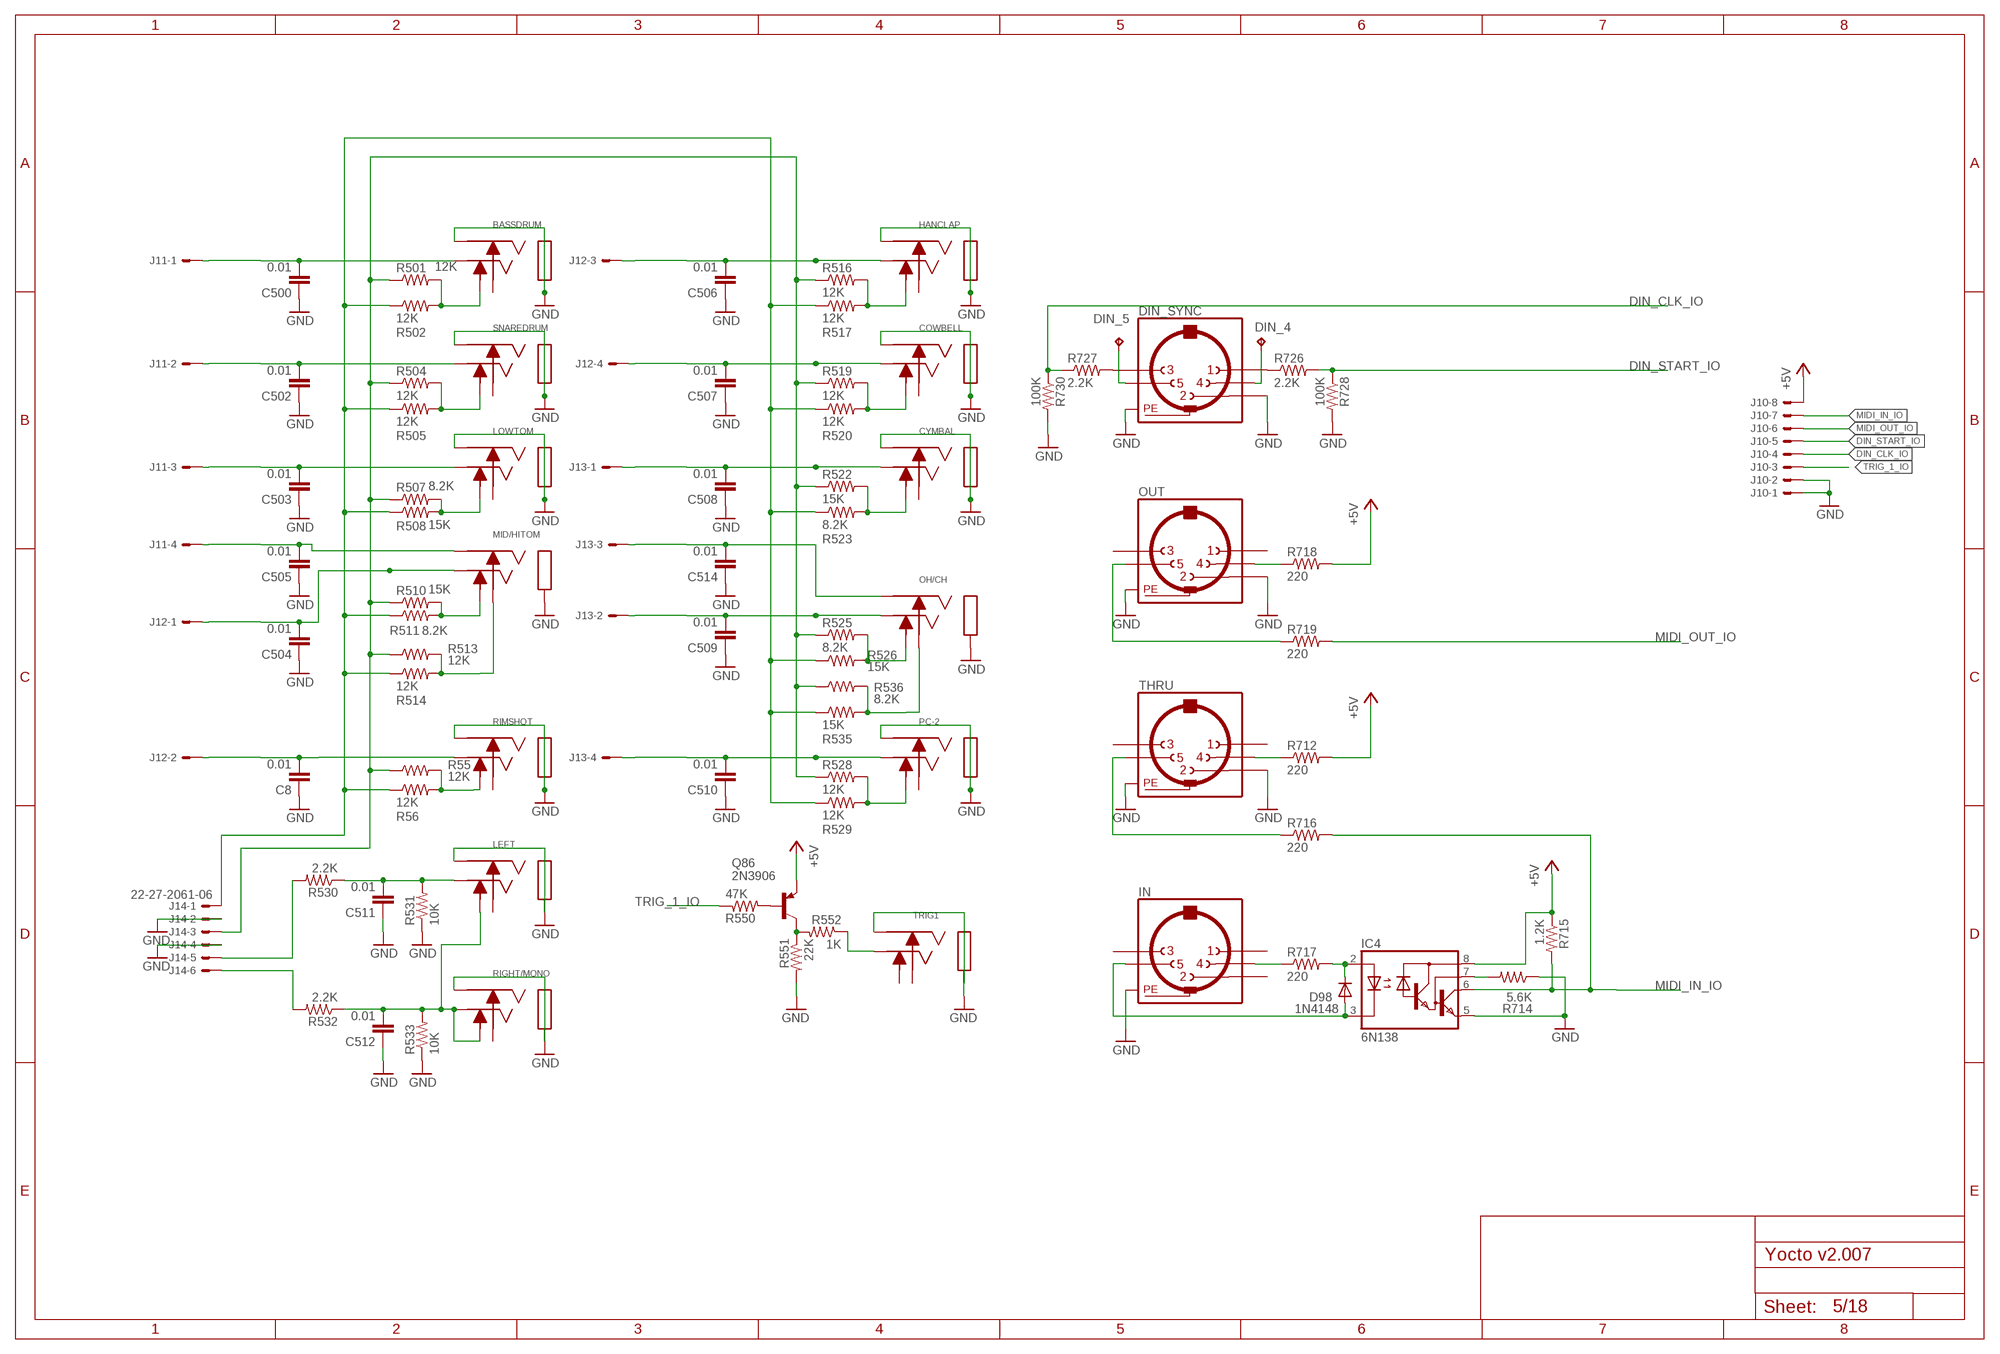
[diagram p5: schematic, sheet 5]

### Parts
BASSDRUM  JACK_TRSNRJ6HF  [JACK_TRS]
C8  0.01  C-EU050-025X075  [C050-025X075]
C500  0.01  C-EU050-025X075  [C050-025X075]
C502  0.01  C-EU050-025X075  [C050-025X075]
C503  0.01  C-EU050-025X075  [C050-025X075]
C504  0.01  C-EU050-025X075  [C050-025X075]
C505  0.01  C-EU050-025X075  [C050-025X075]
C506  0.01  C-EU050-025X075  [C050-025X075]
C507  0.01  C-EU050-025X075  [C050-025X075]
C508  0.01  C-EU050-025X075  [C050-025X075]
C509  0.01  C-EU050-025X075  [C050-025X075]
C510  0.01  C-EU050-025X075  [C050-025X075]
C511  0.01  C-EU050-025X075  [C050-025X075]
C512  0.01  C-EU050-025X075  [C050-025X075]
C514  0.01  C-EU050-025X075  [C050-025X075]
COWBELL  JACK_TRSNRJ6HF  [JACK_TRS]
CYMBAL  JACK_TRSNRJ6HF  [JACK_TRS]
D98  1N4148  [DO35-7C]
DIN_4  TPB0,8  [B0,8]
DIN_5  TPB0,8  [B0,8]
DIN_SYNC  MAB5SH  [MAB5SH]
HANCLAP  JACK_TRSNRJ6HF  [JACK_TRS]
IC4  6N138  [DIL08]
IN  MAB5SH  [MAB5SH]
J10  22-27-2081-08  [6410-08]
J11  22-27-2041-04  [6410-04]
J12  22-27-2041-04  [6410-04]
J13  22-27-2041-04  [6410-04]
J14  22-27-2061-06  [6410-06]
LEFT  JACK_TRSNRJ6HF  [JACK_TRS]
LOWTOM  JACK_TRSNRJ6HF  [JACK_TRS]
MID/HITOM  JACK_TRSNRJ6HF  [JACK_TRS]
OH/CH  JACK_TRSNRJ6HF  [JACK_TRS]
OUT  MAB5SH  [MAB5SH]
PC-2  JACK_TRSNRJ6HF  [JACK_TRS]
Q86  2N3906  [TO92-EBC-SMALL]
R55  12K  R-US_0207/7  [0207/7]
R56  12K  R-US_0207/7  [0207/7]
R501  12K  R-US_0207/7  [0207/7]
R502  12K  R-US_0207/7  [0207/7]
R504  12K  R-US_0207/7  [0207/7]
R505  12K  R-US_0207/7  [0207/7]
R507  8.2K  R-US_0207/7  [0207/7]
R508  15K  R-US_0207/7  [0207/7]
R510  15K  R-US_0207/7  [0207/7]
R511  8.2K  R-US_0207/7  [0207/7]
R513  12K  R-US_0207/7  [0207/7]
R514  12K  R-US_0207/7  [0207/7]
R516  12K  R-US_0207/7  [0207/7]
R517  12K  R-US_0207/7  [0207/7]
R519  12K  R-US_0207/7  [0207/7]
R520  12K  R-US_0207/7  [0207/7]
R522  15K  R-US_0207/7  [0207/7]
R523  8.2K  R-US_0207/7  [0207/7]
R525  8.2K  R-US_0207/7  [0207/7]
R526  15K  R-US_0207/7  [0207/7]
R528  12K  R-US_0207/7  [0207/7]
R529  12K  R-US_0207/7  [0207/7]
R530  2.2K  R-US_0207/7  [0207/7]
R531  10K  R-US_0207/7  [0207/7]
R532  2.2K  R-US_0207/7  [0207/7]
R533  10K  R-US_0207/7  [0207/7]
R535  15K  R-US_0207/7  [0207/7]
R536  8.2K  R-US_0207/7  [0207/7]
R550  47K  R-US_0207/7  [0207/7]
R551  22K  R-US_0207/7  [0207/7]
R552  1K  R-US_0207/7  [0207/7]
R712  220  R-US_0207/7  [0207/7]
R714  5.6K  R-US_0207/7  [0207/7]
R715  1.2K  R-US_0207/7  [0207/7]
R716  220  R-US_0207/7  [0207/7]
R717  220  R-US_0207/7  [0207/7]
R718  220  R-US_0207/7  [0207/7]
R719  220  R-US_0207/7  [0207/7]
R726  2.2K  R-US_0207/7  [0207/7]
R727  2.2K  R-US_0207/7  [0207/7]
R728  100K  R-US_0207/7  [0207/7]
R730  100K  R-US_0207/7  [0207/7]
RIGHT/MONO  JACK_TRSNRJ6HF  [JACK_TRS]
RIMSHOT  JACK_TRSNRJ6HF  [JACK_TRS]
SNAREDRUM  JACK_TRSNRJ6HF  [JACK_TRS]
THRU  MAB5SH  [MAB5SH]
TRIG1  JACK_TRSNRJ6HF  [JACK_TRS]

### Nets
+5V [power]: IC4.8(VCC) J10.8 Q86.E R712.2 R715.1 R718.2 ; also sheet 1,3,4
DIN_CLK_IO [special]: J10.4 R727.1 R730.1
DIN_START_IO [special]: J10.5 R726.2 R728.1
GND [GND]: BASSDRUM.R BASSDRUM.S C8.1 C500.1 C502.1 C503.1 C504.1 C505.1 C506.1 C507.1 C508.1 C509.1 C510.1 C511.1 C512.1 C514.1 COWBELL.R COWBELL.S CYMBAL.R CYMBAL.S DIN_SYNC.2 DIN_SYNC.PE DIN_SYNC.PE@(PE) HANCLAP.R HANCLAP.S IC4.5(GND) IN.PE IN.PE@(PE) J10.1 J10.2 J14.2 J14.4 LEFT.R LEFT.S LOWTOM.R LOWTOM.S MID/HITOM.S OH/CH.S OUT.2 OUT.PE OUT.PE@(PE) PC-2.R PC-2.S R531.1 R533.1 R551.2 R714.1 R728.2 R730.2 RIGHT/MONO.R RIGHT/MONO.S RIMSHOT.R RIMSHOT.S SNAREDRUM.R SNAREDRUM.S THRU.2 THRU.PE THRU.PE@(PE) TRIG1.R TRIG1.S ; also sheet 1,2,3,4,6,7,8,9,10,11,12,13,14,15,16,17,18
MIDI_IN_IO [special]: IC4.6(VO) J10.7 R715.2 R716.2
MIDI_OUT_IO [special]: J10.6 R719.2
N$276: R552.1 TRIG1.T
N$413: R55.2 R56.2 RIMSHOT.TN
N$414: C8.2 J12.2 RIMSHOT.T
N$419: OH/CH.RN R535.2 R536.2
N$424: C514.2 J13.3 OH/CH.R
N$427: DIN_5.P$1(TP) DIN_SYNC.5
N$776: DIN_4.P$1(TP) DIN_SYNC.4
N$793: BASSDRUM.TN R501.2 R502.2
N$794: BASSDRUM.T C500.2 J11.1
N$795: Q86.B R550.2
N$797: C512.2 LEFT.TN R532.1 R533.2 RIGHT/MONO.T RIGHT/MONO.TN
N$798: R504.2 R505.2 SNAREDRUM.TN
N$799: C502.2 J11.2 SNAREDRUM.T
N$801: C511.2 LEFT.T R530.1 R531.2
N$802: LOWTOM.TN R507.2 R508.2
N$803: C503.2 J11.3 LOWTOM.T
N$806: MID/HITOM.TN R510.2 R511.2
N$807: C504.2 J12.1 MID/HITOM.T
N$810: MID/HITOM.RN R513.2 R514.2
N$811: C505.2 J11.4 MID/HITOM.R
N$812: J14.1 R56.1 R502.1 R505.1 R508.1 R511.1 R514.1 R517.1 R520.1 R523.1 R526.1 R529.1 R535.1
N$814: HANCLAP.TN R516.2 R517.2
N$815: C506.2 HANCLAP.T J12.3
N$818: COWBELL.TN R519.2 R520.2
N$819: IN.4 R717.1
N$820: D98.C IC4.2(A) R717.2
N$821: D98.A IC4.3(C) IN.5
N$822: R712.1 THRU.4
N$823: R716.1 THRU.5
N$824: IC4.7(VB) R714.2
N$825: OUT.4 R718.1
N$826: OUT.5 R719.1
N$827: DIN_SYNC.1 R726.1
N$828: DIN_SYNC.3 R727.2
N$829: C507.2 COWBELL.T J12.4
N$832: Q86.C R551.1 R552.2
N$836: CYMBAL.TN R522.2 R523.2
N$837: C508.2 CYMBAL.T J13.1
N$838: J14.5 R530.2
N$839: J14.6 R532.2
N$840: OH/CH.TN R525.2 R526.2
N$841: C509.2 J13.2 OH/CH.T
N$844: PC-2.TN R528.2 R529.2
N$845: C510.2 J13.4 PC-2.T
N$847: J14.3 R55.1 R501.1 R504.1 R507.1 R510.1 R513.1 R516.1 R519.1 R522.1 R525.1 R528.1 R536.1
TRIG_1_IO [special]: J10.3 R550.1
Unconnected: BASSDRUM.RN COWBELL.RN CYMBAL.RN HANCLAP.RN IN.1 IN.2 IN.3 LEFT.RN LOWTOM.RN OUT.1 OUT.3 PC-2.RN RIGHT/MONO.RN RIMSHOT.RN SNAREDRUM.RN THRU.1 THRU.3 TRIG1.RN TRIG1.TN

## Sheet 6 of 18: NOISE
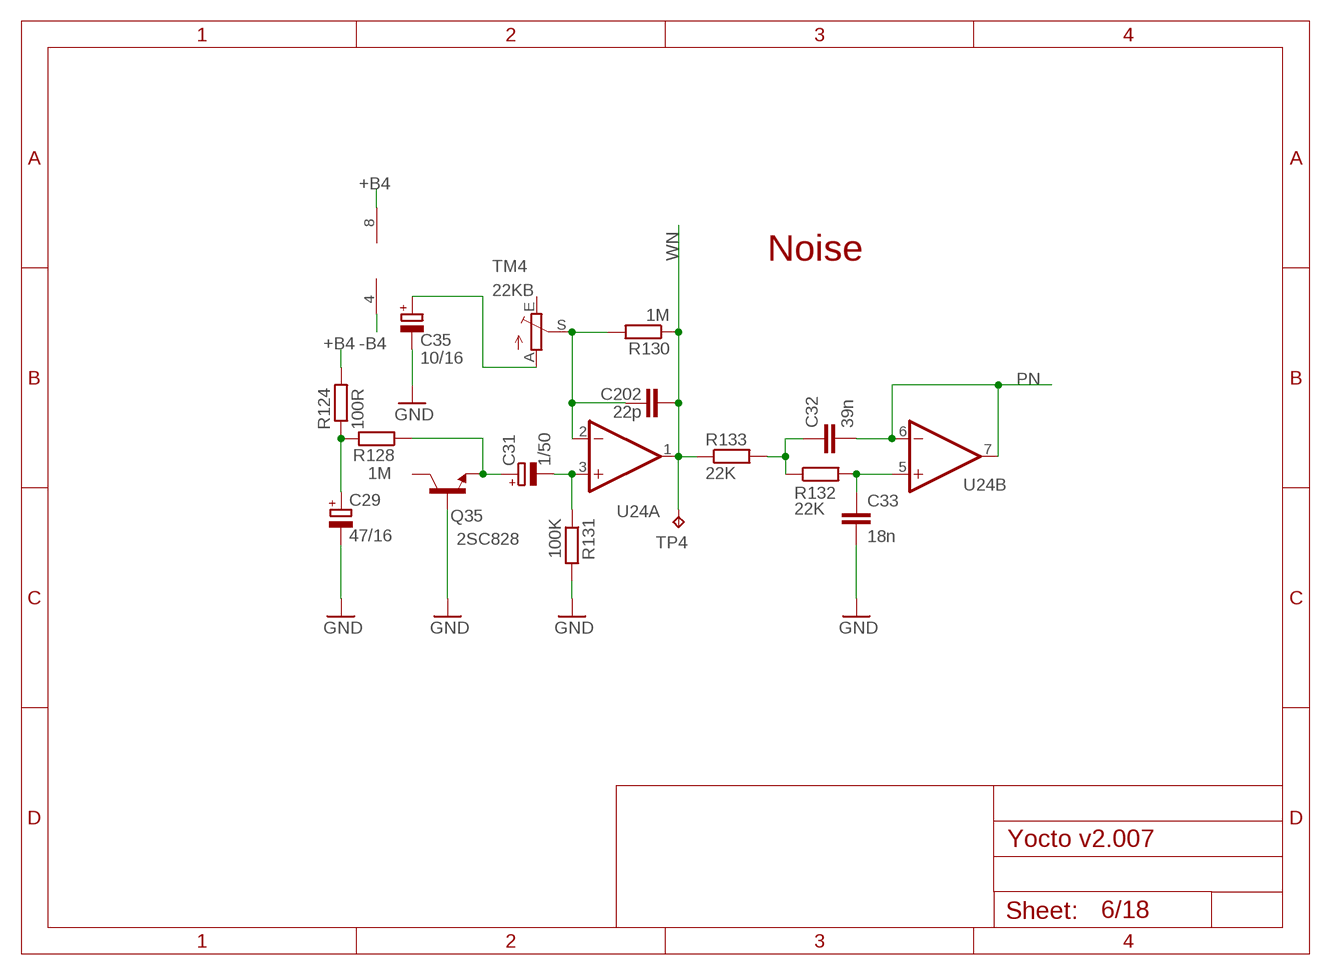
[diagram p6: schematic, sheet 6]

### Parts
C29  47/16  CPOL-EUE2.5-6  [E2,5-6]
C31  1/50  CPOL-EUE2-5  [E2-5]
C32  39n  C-EU050-025X075  [C050-025X075]
C33  18n  C-EU050-025X075  [C050-025X075]
C35  10/16  CPOL-EUE2-5  [E2-5]
C202  22p  C-EU025-025X050  [C025-025X050]
Q35  2SC828  [TO-ECB-MARKED2]
R124  100R  R-EU_0207/7  [0207/7]
R128  1M  R-EU_0207/7  [0207/7]
R130  1M  R-EU_0207/7  [0207/7]
R131  100K  R-EU_0207/7  [0207/7]
R132  22K  R-EU_0207/7  [0207/7]
R133  22K  R-EU_0207/7  [0207/7]
TM4  22KB  TRIM_EU-CT6  [CT6]
TP4  TPB0,8  [B0,8]
U24  µPC4558CA  [DIL08]

### Nets
+B4 [power]: R124.2 U24.8(V+) ; also sheet 4,9
-B4 [power]: U24.4(V-) ; also sheet 4,9
GND [GND]: C29.- C33.2 C35.- Q35.B R131.2 ; also sheet 1,2,3,4,5,7,8,9,10,11,12,13,14,15,16,17,18
N$361: C35.+ TM4.A
N$362: C31.- R131.1 U24.3(A:+IN)
N$489: C202.1 R130.2 TM4.S U24.2(A:-IN)
N$491: C31.+ Q35.E R128.1
N$492: C29.+ R124.1 R128.2
N$493: C32.1 R132.1 R133.2
N$494: C33.1 R132.2 U24.5(B:+IN)
PN: C32.2 U24.6(B:-IN) U24.7(B:OUT) ; also sheet 9,10,11
WN: C202.2 R130.1 R133.1 TP4.P$1(TP) U24.1(A:OUT) ; also sheet 8,13
Unconnected: Q35.C TM4.E

### Notes on the sheet
- Noise

## Sheet 7 of 18: BD
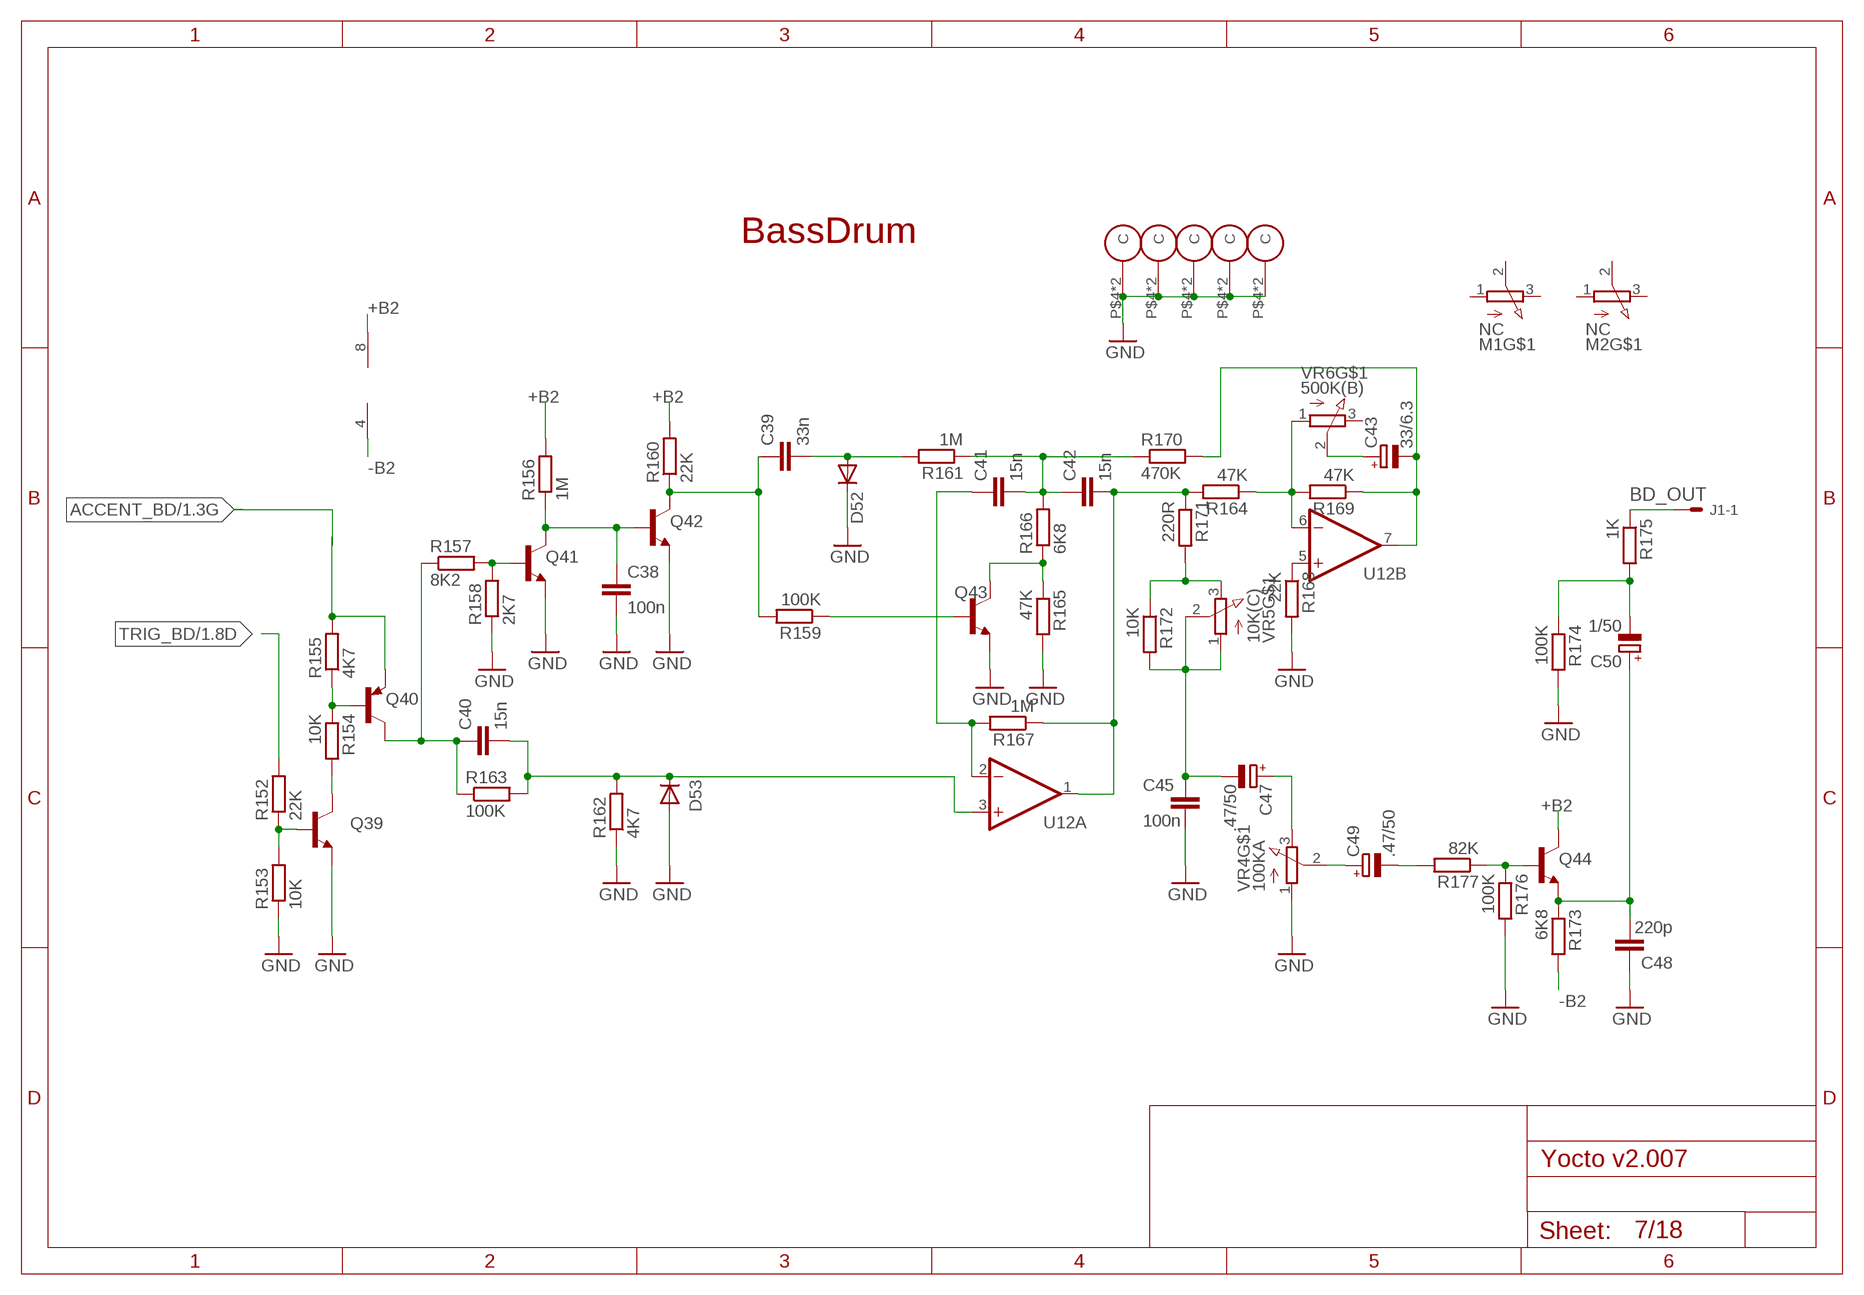
[diagram p7: schematic, sheet 7]

### Parts
C38  100n  C-EU050-025X075  [C050-025X075]
C39  33n  C-EU050-025X075  [C050-025X075]
C40  15n  C-EU050-025X075  [C050-025X075]
C41  15n  C-EU050-025X075  [C050-025X075]
C42  15n  C-EU050-025X075  [C050-025X075]
C43  33/6.3  CPOL-EUE2.5-5  [E2,5-5]
C45  100n  C-EU050-025X075  [C050-025X075]
C47  .47/50  CPOL-EUE2.5-5  [E2,5-5]
C48  220p  C-EU025-025X050  [C025-025X050]
C49  .47/50  CPOL-EUE2.5-5  [E2,5-5]
C50  1/50  CPOL-EUE2.5-5  [E2,5-5]
D52  1N4148DO35-7  [DO35-7]
D53  1N4148DO35-7  [DO35-7]
J1  22-27-2041-04  [6410-04]
M1  NC  POT_8089MM  [R0903N]
M2  NC  POT_8089MM  [R0903N]
Q39  2SC945  [TO-92-ECB-PERSO]
Q40  2SA733  [TO-92-ECB-MARKED]
Q41  2SC945  [TO-92-ECB-PERSO]
Q42  2SC945  [TO-92-ECB-PERSO]
Q43  2SC945  [TO-92-ECB-PERSO]
Q44  2SC945  [TO-92-ECB-PERSO]
R152  22K  R-EU_0207/7  [0207/7]
R153  10K  R-EU_0207/7  [0207/7]
R154  10K  R-EU_  [0207/7]
R155  4K7  R-EU_0207/5V  [0207/5V]
R156  1M  R-EU_0207/5V  [0207/5V]
R157  8K2  R-EU_0207/5V  [0207/5V]
R158  2K7  R-EU_0207/5V  [0207/5V]
R159  100K  R-EU_0207/5V  [0207/5V]
R160  22K  R-EU_0207/5V  [0207/5V]
R161  1M  R-EU_0207/5V  [0207/5V]
R162  4K7  R-EU_0207/5V  [0207/5V]
R163  100K  R-EU_0207/5V  [0207/5V]
R164  47K  R-EU_  [0207/7]
R165  47K  R-EU_0207/5V  [0207/5V]
R166  6K8  R-EU_0207/5V  [0207/5V]
R167  1M  R-EU_0207/5V  [0207/5V]
R168  22K  R-EU_0207/5V  [0207/5V]
R169  47K  R-EU_0207/5V  [0207/5V]
R170  470K  R-EU_  [0207/7]
R171  220R  R-EU_0207/5V  [0207/5V]
R172  10K  R-EU_0207/5V  [0207/5V]
R173  6K8  R-EU_0207/5V  [0207/5V]
R174  100K  R-EU_0207/5V  [0207/5V]
R175  1K  R-EU_0207/5V  [0207/5V]
R176  100K  R-EU_0207/7  [0207/7]
R177  82K  R-EU_0207/5V  [0207/5V]
U12  µPC4558CA  [DIL08]
VR4  100KA  POT_8089MM  [R0903N]
VR5  10K(C)  POT_8089MM  [R0903N]
VR6  500K(B)  POT_8089MM  [R0903N]

### Nets
+B2 [power]: Q44.C R156.2 R160.2 U12.8(V+) ; also sheet 4
-B2 [power]: R173.2 U12.4(V-) ; also sheet 4
ACCENT_BD: Q40.E R155.2 ; also sheet 1
BD_OUT: J1.1 R175.1
C1: C49.- R177.2
GND [GND]: C38.2 C45.2 C48.1 D52.C D53.A M1.P$4(C) M1.P$5(C) M2.P$4(C) M2.P$5(C) Q39.E Q41.E Q42.E Q43.E R153.1 R158.1 R162.1 R165.2 R168.2 R174.2 R176.2 VR4.1(A) VR4.P$4(C) VR4.P$5(C) VR5.P$4(C) VR5.P$5(C) VR6.P$4(C) VR6.P$5(C) ; also sheet 1,2,3,4,5,6,8,9,10,11,12,13,14,15,16,17,18
N$46: C38.1 Q41.C Q42.B R156.1
N$47: Q40.B R154.1 R155.1
N$48: Q39.C R154.2
N$49: C39.1 Q42.C R159.2 R160.1
N$50: C40.1 Q40.C R157.1 R163.1
N$51: C40.2 D53.C R162.2 R163.2 U12.3(A:+IN)
N$52: Q43.B R159.1
N$53: C41.2 C42.1 R161.1 R166.2 R170.1
N$54: C41.1 R167.2 U12.2(A:-IN)
N$55: C42.2 R164.2 R167.1 R171.1 U12.1(A:OUT)
N$56: C45.1 C47.- R172.2 VR5.1(A) VR5.2(S)
N$57: R171.2 R172.1 VR5.3(E)
N$58: R164.1 R169.2 U12.6(B:-IN) VR6.1(A)
N$59: C43.- R169.1 R170.2 U12.7(B:OUT)
N$60: Q44.B R176.1 R177.1
N$61: C48.2 C50.+ Q44.E R173.1
N$62: C50.- R174.1 R175.2
N$63: C47.+ VR4.3(E)
N$64: C49.+ VR4.2(S)
N$65: C39.2 D52.A R161.2
N$66: C43.+ VR6.2(S)
N$67: R168.1 U12.5(B:+IN)
N$68: Q41.B R157.2 R158.2
N$69: Q43.C R165.1 R166.1
N$70: Q39.B R152.1 R153.2
TRIG_BD: R152.2 ; also sheet 1
Unconnected: M1.1(A) M1.2(S) M1.3(E) M2.1(A) M2.2(S) M2.3(E) VR6.3(E)

### Notes on the sheet
- BassDrum

## Sheet 8 of 18: SD
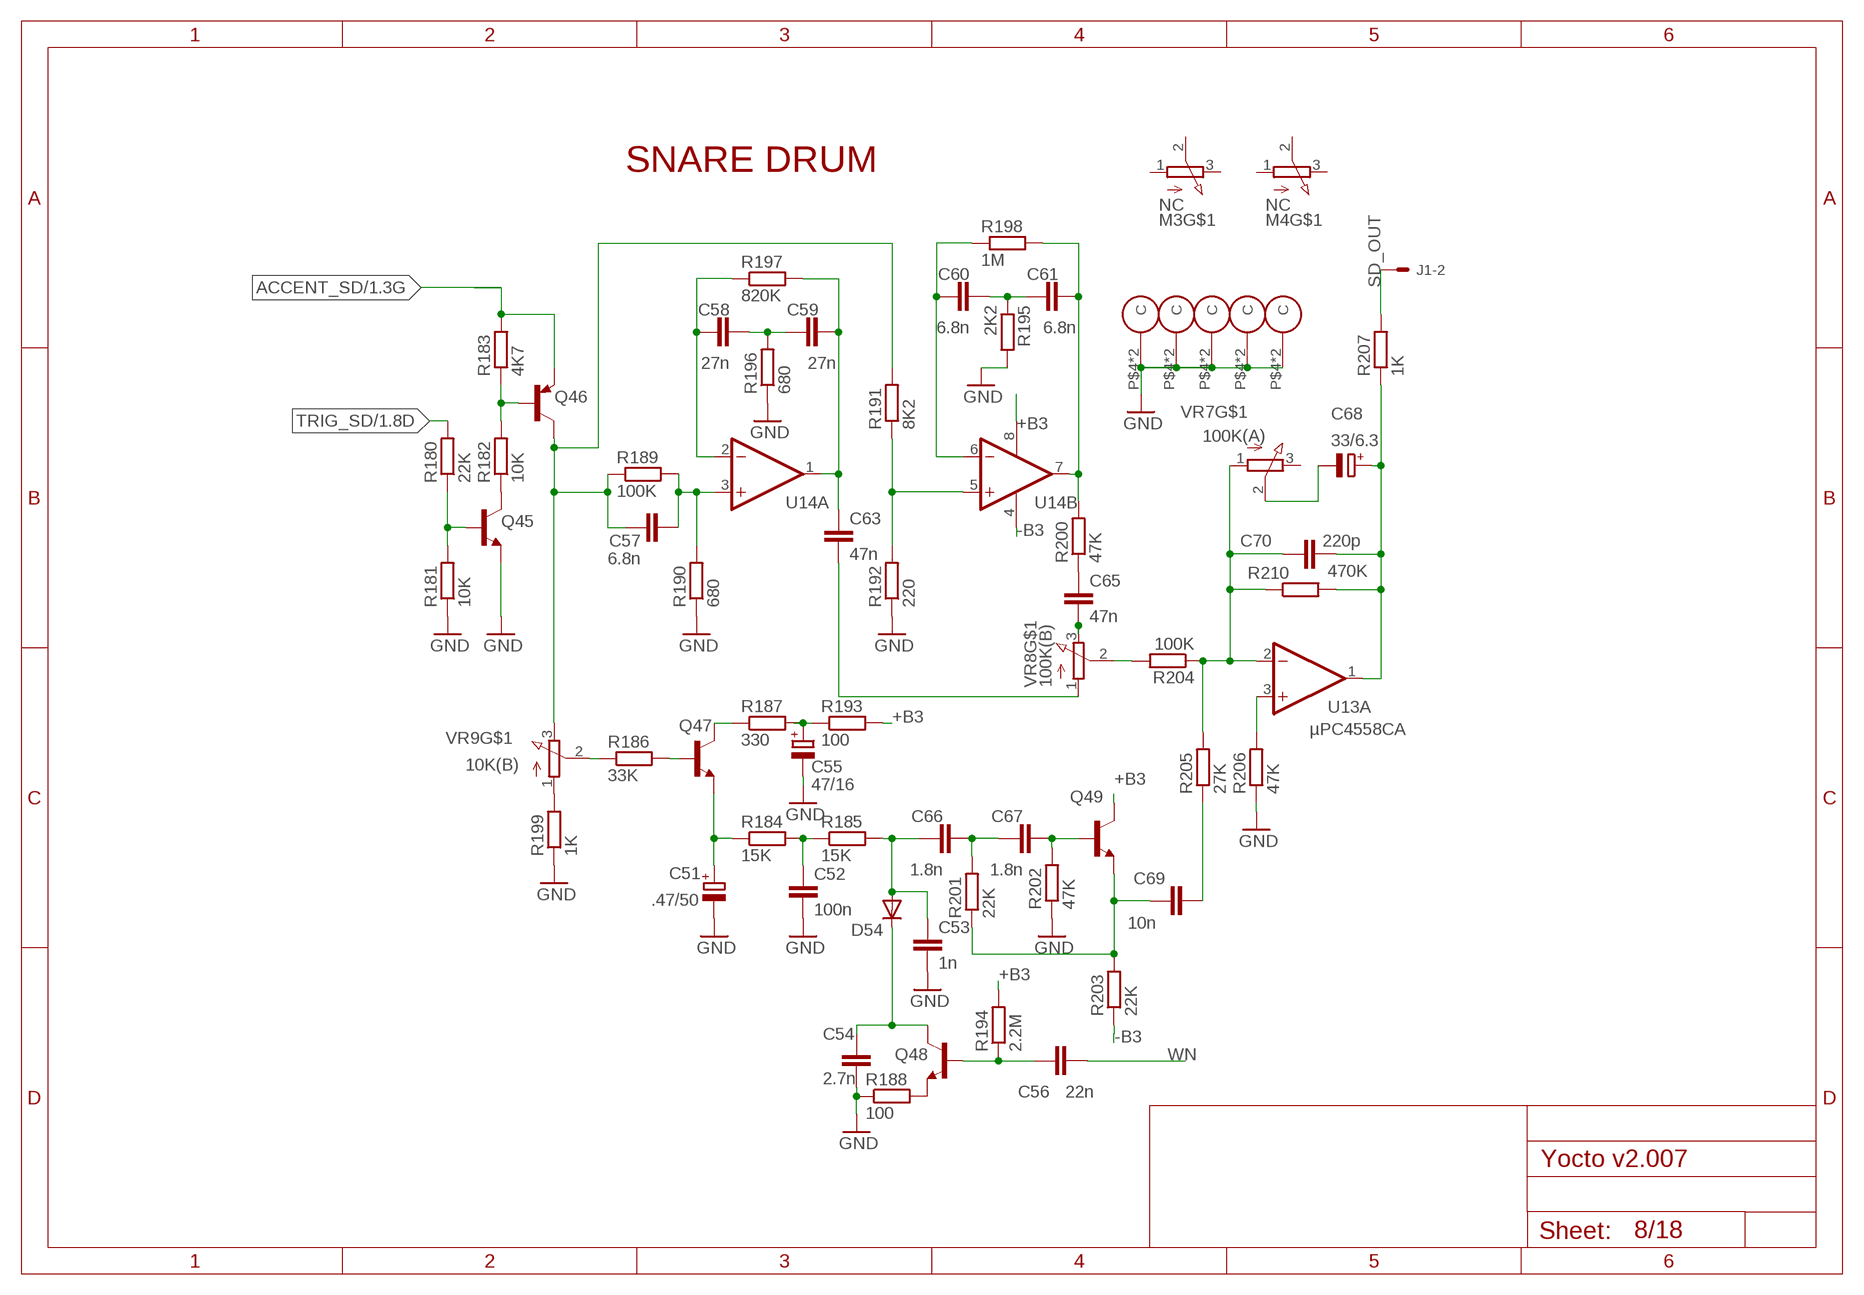
[diagram p8: schematic, sheet 8]

### Parts
C51  .47/50  CPOL-EUE2-5  [E2-5]
C52  100n  C-EU050-025X075  [C050-025X075]
C53  1n  C-EU050-025X075  [C050-025X075]
C54  2.7n  C-EU050-025X075  [C050-025X075]
C55  47/16  CPOL-EUE2-5  [E2-5]
C56  22n  C-EU050-025X075  [C050-025X075]
C57  6.8n  C-EU050-025X075  [C050-025X075]
C58  27n  C-EU050-025X075  [C050-025X075]
C59  27n  C-EU050-025X075  [C050-025X075]
C60  6.8n  C-EU050-025X075  [C050-025X075]
C61  6.8n  C-EU050-025X075  [C050-025X075]
C63  47n  C-EU050-025X075  [C050-025X075]
C65  47n  C-EU050-025X075  [C050-025X075]
C66  1.8n  C-EU050-025X075  [C050-025X075]
C67  1.8n  C-EU050-025X075  [C050-025X075]
C68  33/6.3  CPOL-EUE2-5  [E2-5]
C69  10n  C-EU050-025X075  [C050-025X075]
C70  220p  C-EU025-025X050  [C025-025X050]
D54  1N4148  [DO35-7C]
M3  NC  POT_8089MM  [R0903N]
M4  NC  POT_8089MM  [R0903N]
Q45  2SC945  [TO-92-ECB-PERSO]
Q46  2SA733  [TO-92-ECB-MARKED]
Q47  2SC945  [TO-92-ECB-PERSO]
Q48  2SC945  [TO-92-ECB-PERSO]
Q49  2SC945  [TO-92-ECB-PERSO]
R180  22K  R-EU_0207/7  [0207/7]
R181  10K  R-EU_0207/7  [0207/7]
R182  10K  R-EU_0207/7  [0207/7]
R183  4K7  R-EU_0207/7  [0207/7]
R184  15K  R-EU_0207/7  [0207/7]
R185  15K  R-EU_0207/7  [0207/7]
R186  33K  R-EU_0207/7  [0207/7]
R187  330  R-EU_0207/7  [0207/7]
R188  100  R-EU_  [0207/7]
R189  100K  R-EU_0207/7  [0207/7]
R190  680  R-EU_0207/7  [0207/7]
R191  8K2  R-EU_0207/7  [0207/7]
R192  220  R-EU_0207/7  [0207/7]
R193  100  R-EU_0207/7  [0207/7]
R194  2.2M  R-EU_0207/7  [0207/7]
R195  2K2  R-EU_0207/7  [0207/7]
R196  680  R-EU_0207/7  [0207/7]
R197  820K  R-EU_0207/7  [0207/7]
R198  1M  R-EU_0207/7  [0207/7]
R199  1K  R-EU_0207/7  [0207/7]
R200  47K  R-EU_0207/7  [0207/7]
R201  22K  R-EU_0207/7  [0207/7]
R202  47K  R-EU_0207/7  [0207/7]
R203  22K  R-EU_0207/7  [0207/7]
R204  100K  R-EU_0207/7  [0207/7]
R205  27K  R-EU_0207/7  [0207/7]
R206  47K  R-EU_0207/7  [0207/7]
R207  1K  R-EU_0207/7  [0207/7]
R210  470K  R-EU_0207/7  [0207/7]
U13  µPC4558CA  [DIL08]
U14  µPC4558CA  [DIL08]
VR7  100K(A)  POT_8089MM  [R0903N]
VR8  100K(B)  POT_8089MM  [R0903N]
VR9  10K(B)  POT_8089MM  [R0903N]

### Nets
+B3 [power]: Q49.C R193.2 R194.2 U14.8(V+) ; also sheet 4,9
-B3 [power]: R203.1 U14.4(V-) ; also sheet 4,9
ACCENT_SD: Q46.E R183.2 ; also sheet 1
GND [GND]: C51.- C52.2 C53.2 C54.2 C55.- M3.P$4(C) M3.P$5(C) M4.P$4(C) M4.P$5(C) Q45.E R181.1 R188.1 R190.1 R192.1 R195.2 R196.1 R199.1 R202.1 R206.1 VR7.P$4(C) VR7.P$5(C) VR8.P$4(C) VR8.P$5(C) VR9.P$4(C) VR9.P$5(C) ; also sheet 1,2,3,4,5,6,7,9,10,11,12,13,14,15,16,17,18
N$25: Q45.B R180.1 R181.2
N$26: Q46.B R182.2 R183.1
N$27: Q45.C R182.1
N$28: C57.2 R189.2 R190.2 U14.3(A:+IN)
N$29: C57.1 Q46.C R189.1 R191.2 VR9.3(E)
N$30: C58.1 R197.1 U14.2(A:-IN)
N$31: C59.2 C63.1 R197.2 U14.1(A:OUT)
N$32: C58.2 C59.1 R196.2
N$33: C61.2 R198.2 R200.2 U14.7(B:OUT)
N$34: C60.2 C61.1 R195.1
N$35: R191.1 R192.2 U14.5(B:+IN)
N$36: C63.2 VR8.1(A)
N$37: C65.1 R200.1
N$38: R199.2 VR9.1(A)
N$39: C52.1 R184.2 R185.1
N$40: R186.1 VR9.2(S)
N$41: Q47.B R186.2
N$42: Q47.C R187.1
N$43: C55.+ R187.2 R193.1
N$44: C51.+ Q47.E R184.1
N$45: C53.1 C66.1 D54.A R185.2
N$71: C66.2 C67.1 R201.2
N$72: C67.2 Q49.B R202.2
N$73: C69.1 Q49.E R201.1 R203.2
N$74: Q48.E R188.2
N$75: C54.1 D54.C Q48.C
N$76: C56.1 Q48.B R194.1
N$77: R204.2 VR8.2(S)
N$78: C70.1 R204.1 R205.2 R210.1 U13.2(A:-IN) VR7.1(A)
N$79: C69.2 R205.1
N$80: R206.2 U13.3(A:+IN)
N$81: C65.2 VR8.3(E)
N$129: C68.+ C70.2 R207.1 R210.2 U13.1(A:OUT)
N$159: C68.- VR7.2(S)
N$160: C60.1 R198.1 U14.6(B:-IN)
SD_OUT: J1.2 R207.2
TRIG_SD: R180.2 ; also sheet 1
WN: C56.2 ; also sheet 6,13
Unconnected: M3.1(A) M3.2(S) M3.3(E) M4.1(A) M4.2(S) M4.3(E) VR7.3(E)

### Notes on the sheet
- SNARE DRUM

## Sheet 9 of 18: LT
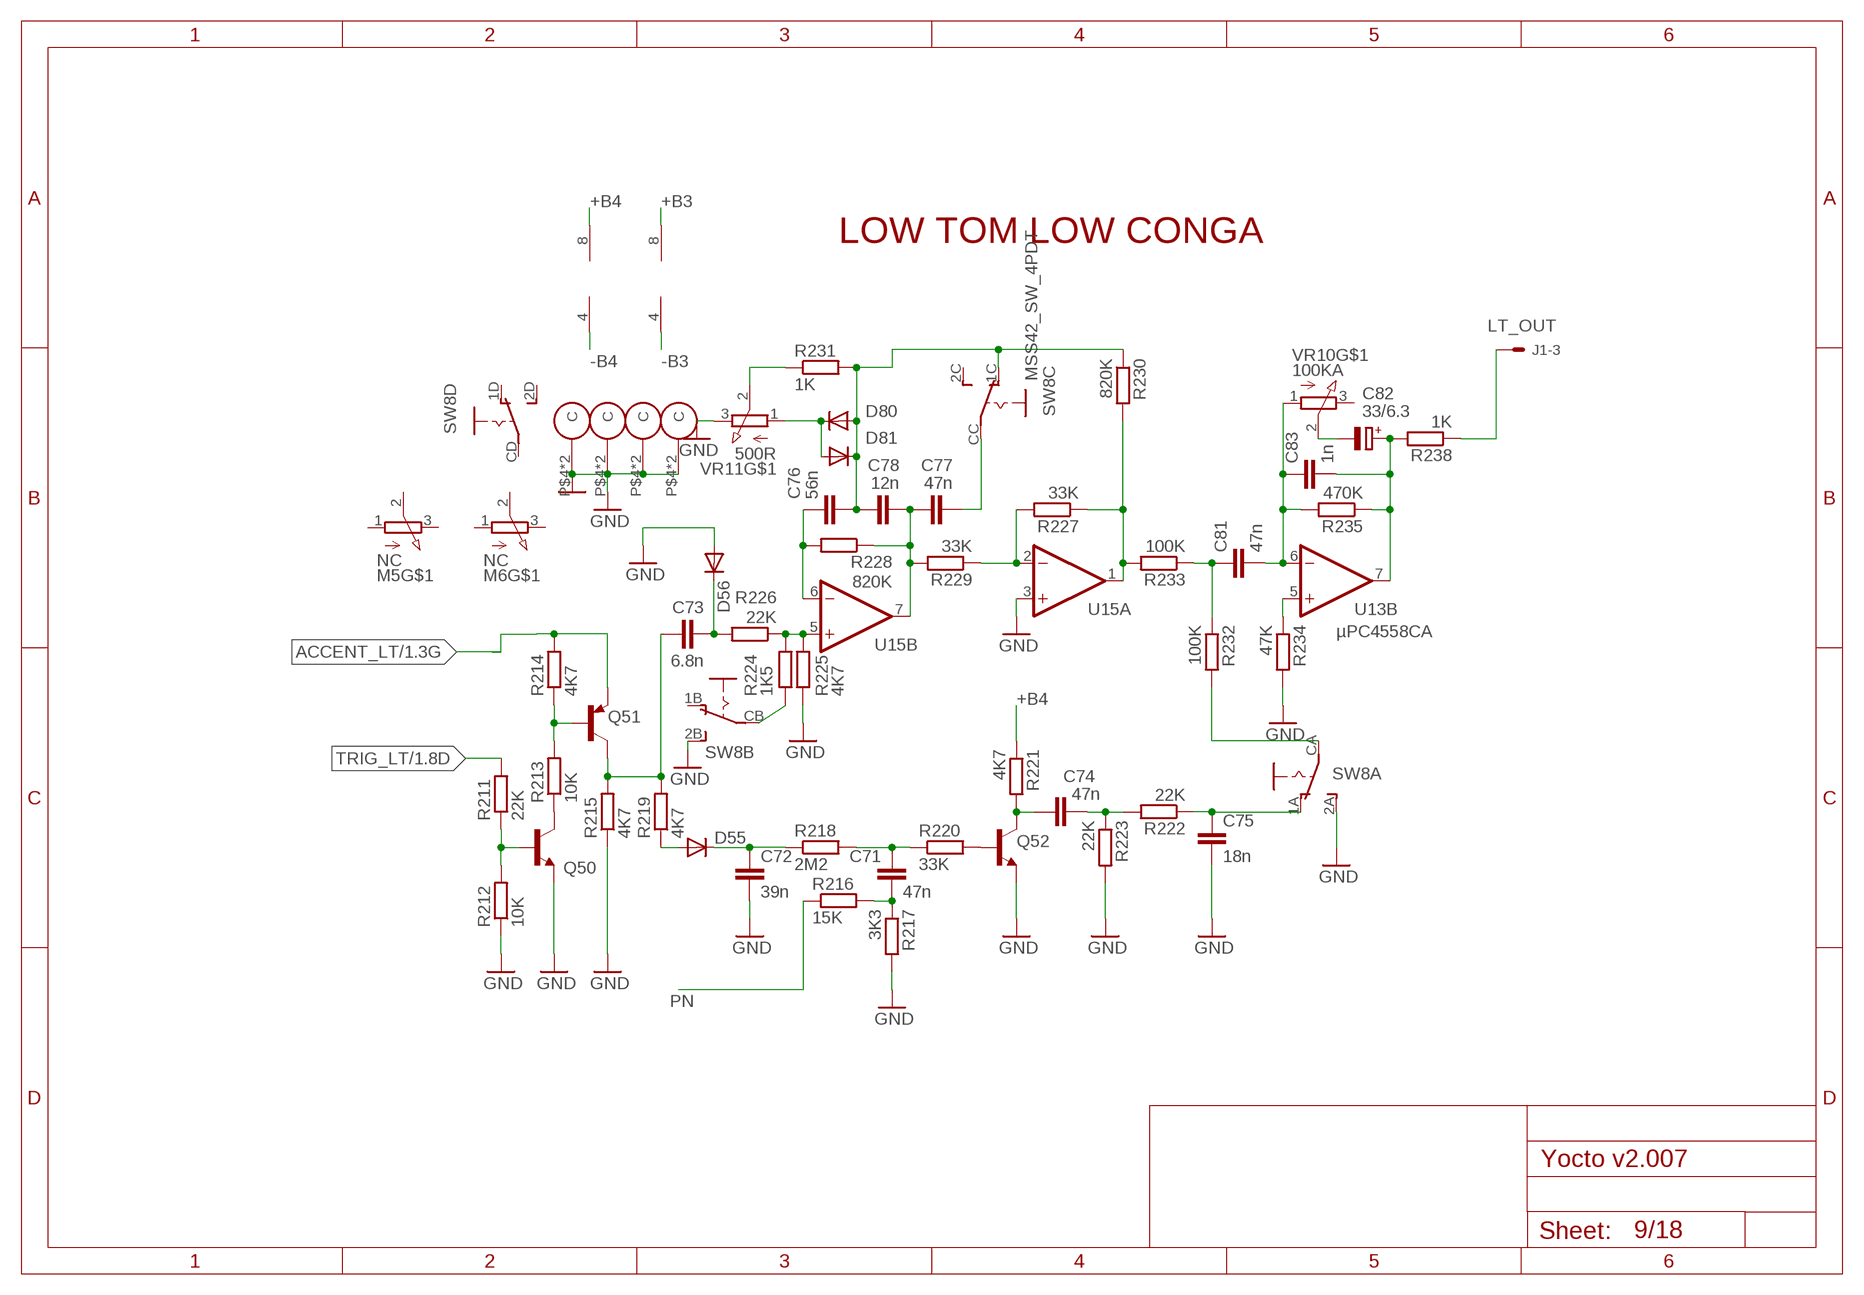
[diagram p9: schematic, sheet 9]

### Parts
C71  47n  C-EU050-025X075  [C050-025X075]
C72  39n  C-EU050-025X075  [C050-025X075]
C73  6.8n  C-EU050-025X075  [C050-025X075]
C74  47n  C-EU050-025X075  [C050-025X075]
C75  18n  C-EU050-025X075  [C050-025X075]
C76  56n  C-EU050-025X075  [C050-025X075]
C77  47n  C-EU050-025X075  [C050-025X075]
C78  12n  C-EU050-025X075  [C050-025X075]
C81  47n  C-EU050-025X075  [C050-025X075]
C82  33/6.3  CPOL-EUE2-5  [E2-5]
C83  1n  C-EU050-025X075  [C050-025X075]
D55  1N4148  [DO35-7C]
D56  1N4148  [DO35-7C]
D80  1N34  1N4148  [DO35-7C]
D81  1N34  1N4148  [DO35-7C]
M5  NC  POT_8089MM  [R0903N]
M6  NC  POT_8089MM  [R0903N]
Q50  2SC945  [TO-92-ECB-PERSO]
Q51  2SA733  [TO-92-ECB-MARKED]
Q52  2SC945  [TO-92-ECB-PERSO]
R211  22K  R-EU_0207/7  [0207/7]
R212  10K  R-EU_0207/7  [0207/7]
R213  10K  R-EU_0207/7  [0207/7]
R214  4K7  R-EU_0207/7  [0207/7]
R215  4K7  R-EU_0207/7  [0207/7]
R216  15K  R-EU_0207/7  [0207/7]
R217  3K3  R-EU_0207/7  [0207/7]
R218  2M2  R-EU_0207/7  [0207/7]
R219  4K7  R-EU_0207/7  [0207/7]
R220  33K  R-EU_0207/7  [0207/7]
R221  4K7  R-EU_0207/7  [0207/7]
R222  22K  R-EU_0207/7  [0207/7]
R223  22K  R-EU_0207/7  [0207/7]
R224  1K5  R-EU_0207/7  [0207/7]
R225  4K7  R-EU_0207/7  [0207/7]
R226  22K  R-EU_0207/7  [0207/7]
R227  33K  R-EU_0207/7  [0207/7]
R228  820K  R-EU_0207/7  [0207/7]
R229  33K  R-EU_0207/7  [0207/7]
R230  820K  R-EU_0207/7  [0207/7]
R231  1K  R-EU_0207/7  [0207/7]
R232  100K  R-EU_0207/7  [0207/7]
R233  100K  R-EU_0207/7  [0207/7]
R234  47K  R-EU_0207/7  [0207/7]
R235  470K  R-EU_0207/7  [0207/7]
R238  1K  R-EU_0207/7  [0207/7]
SW8  MSS42_SW_4PDT  [MSS42_SW_SLIDE]
U15  µPC4558CA  [DIL08]
VR10  100KA  POT_8089MM  [R0903N]
VR11  500R  POT_8089MM  [R0903N]

### Nets
+B3 [power]: U13.8(V+) ; also sheet 4,8
+B4 [power]: R221.1 U15.8(V+) ; also sheet 4,6
-B3 [power]: U13.4(V-) ; also sheet 4,8
-B4 [power]: U15.4(V-) ; also sheet 4,6
ACCENT_LT: Q51.E R214.2 ; also sheet 1
GND [GND]: C72.2 C75.2 D56.A M5.P$4(C) M5.P$5(C) M6.P$4(C) M6.P$5(C) Q50.E Q52.E R212.1 R215.1 R217.2 R223.2 R225.1 R234.2 SW8.2A(A:S) SW8.2B(B:S) SW8.P$1(GND) SW8.P$2(GND) SW8.P$3(GND) SW8.P$4(GND) U15.3(A:+IN) VR10.P$4(C) VR10.P$5(C) VR11.3(E) VR11.P$4(C) VR11.P$5(C) ; also sheet 1,2,3,4,5,6,7,8,10,11,12,13,14,15,16,17,18
LT_OUT: J1.3 R238.1
N$82: Q51.B R213.2 R214.1
N$83: Q50.C R213.1
N$84: Q50.B R211.1 R212.2
N$85: C73.1 Q51.C R215.2 R219.2
N$86: D55.A R219.1
N$87: C73.2 D56.C R226.2
N$88: C76.2 C78.1 D80.A D81.C R230.1 R231.2 SW8.1C(C:O)
N$89: C76.1 R228.2 U15.6(B:-IN)
N$90: C77.1 C78.2 R228.1 R229.2 U15.7(B:OUT)
N$91: D80.C D81.A VR11.1(A)
N$92: R231.1 VR11.2(S)
N$93: R227.2 R229.1 U15.2(A:-IN)
N$94: R227.1 R230.2 R233.2 U15.1(A:OUT)
N$95: C81.1 R232.1 R233.1
N$96: C81.2 C83.1 R235.2 U13.6(B:-IN) VR10.1(A)
N$97: C82.- VR10.2(S)
N$98: C82.+ C83.2 R235.1 R238.2 U13.7(B:OUT)
N$99: C74.1 Q52.C R221.2
N$100: C75.1 R222.1 SW8.1A(A:O)
N$101: Q52.B R220.2
N$102: C71.2 R216.2 R217.1
N$103: C72.1 D55.C R218.1
N$104: C77.2 SW8.CC(C:P)
N$105: R232.2 SW8.CA(A:P)
N$106: C74.2 R222.2 R223.1
N$107: R224.2 R225.2 R226.1 U15.5(B:+IN)
N$109: R234.1 U13.5(B:+IN)
N$111: R224.1 SW8.CB(B:P)
N$267: C71.1 R218.2 R220.1
PN: R216.1 ; also sheet 6,10,11
TRIG_LT: R211.2 ; also sheet 1
Unconnected: M5.1(A) M5.2(S) M5.3(E) M6.1(A) M6.2(S) M6.3(E) SW8.1B(B:O) SW8.1D(D:O) SW8.2C(C:S) SW8.2D(D:S) SW8.CD(D:P) VR10.3(E)

### Notes on the sheet
- LOW TOM LOW CONGA

## Sheet 10 of 18: MT
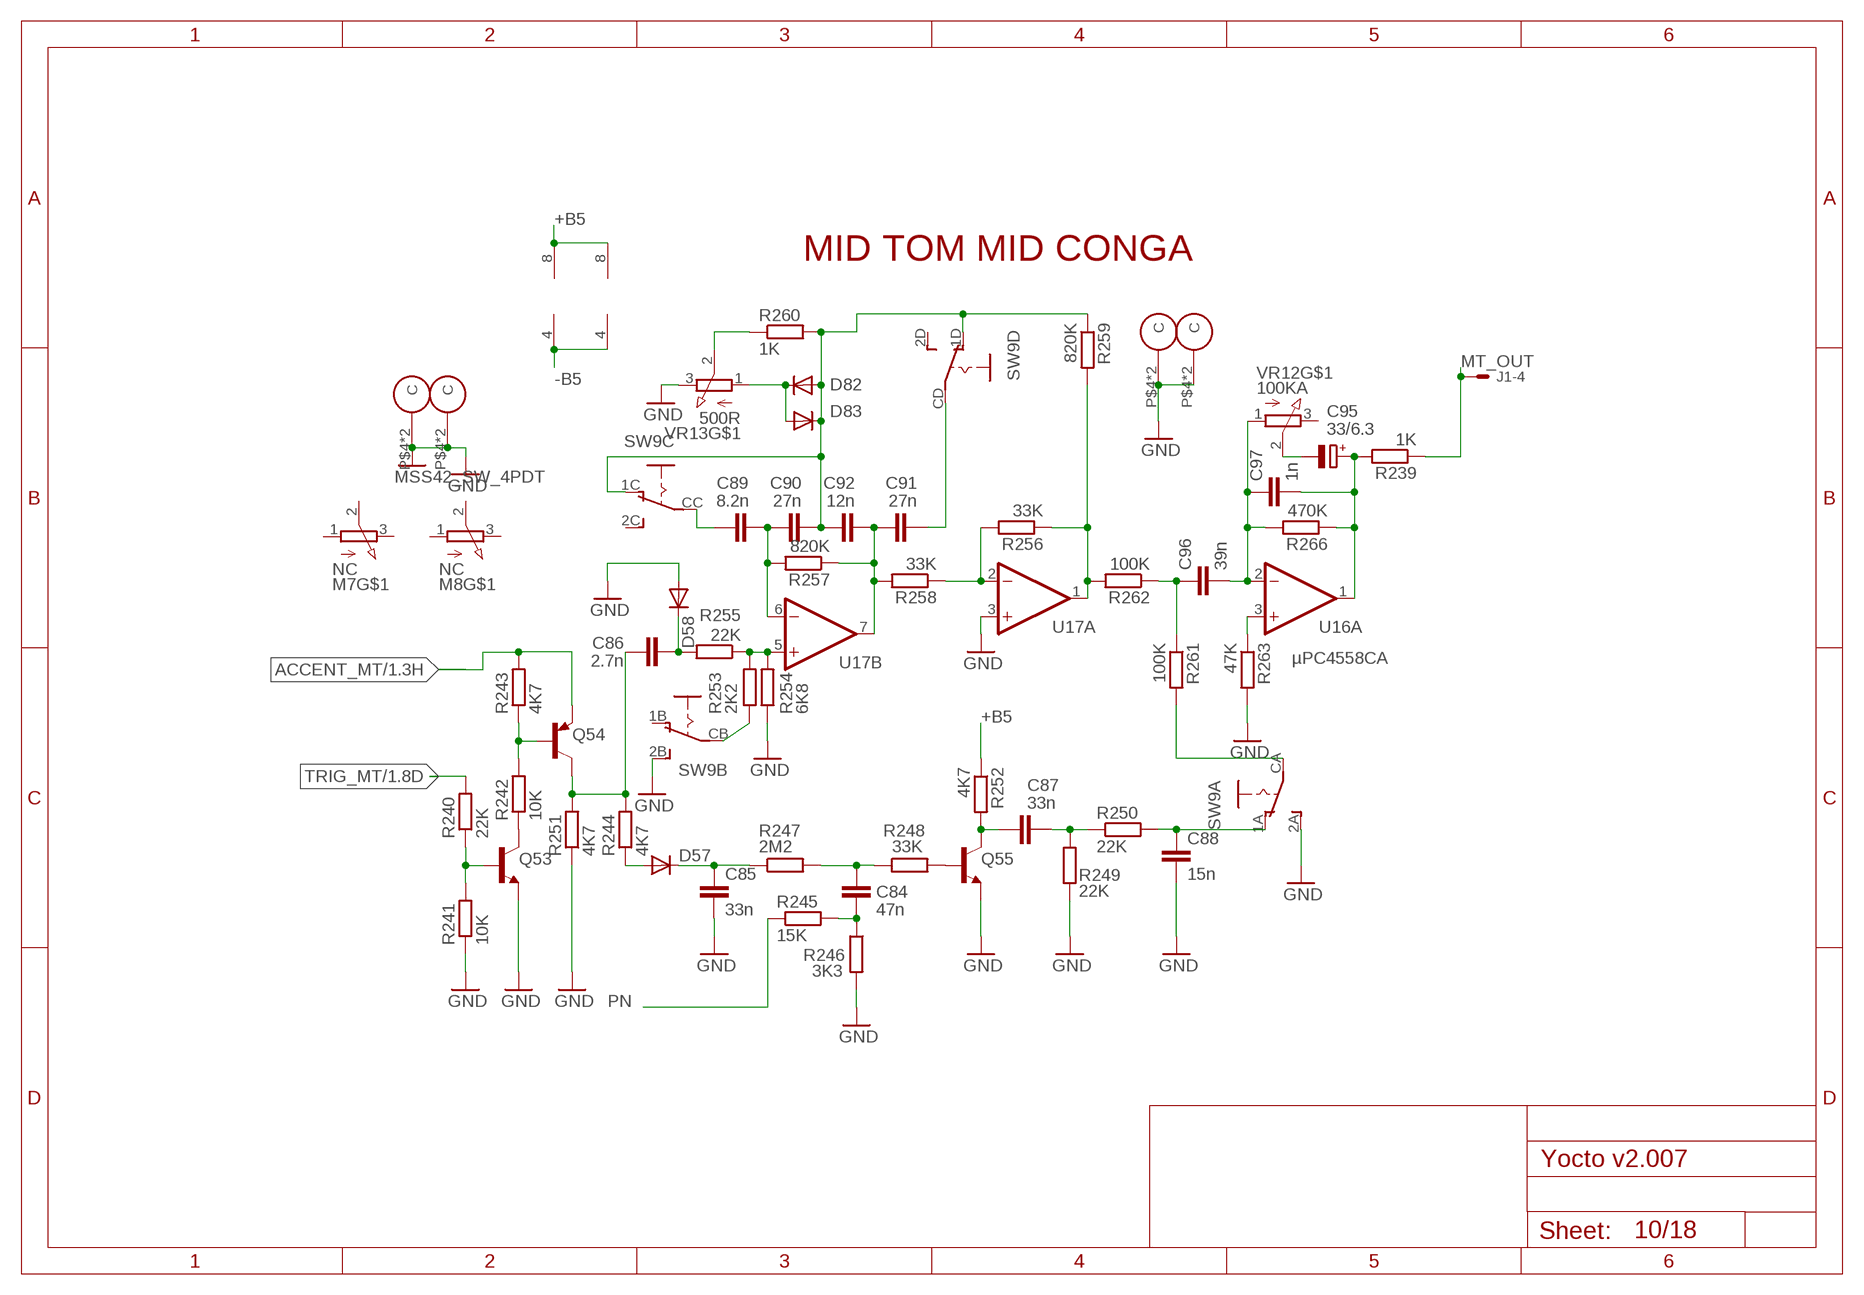
[diagram p10: schematic, sheet 10]

### Parts
C84  47n  C-EU050-025X075  [C050-025X075]
C85  33n  C-EU050-025X075  [C050-025X075]
C86  2.7n  C-EU050-025X075  [C050-025X075]
C87  33n  C-EU050-025X075  [C050-025X075]
C88  15n  C-EU050-025X075  [C050-025X075]
C89  8.2n  C-EU050-025X075  [C050-025X075]
C90  27n  C-EU050-025X075  [C050-025X075]
C91  27n  C-EU050-025X075  [C050-025X075]
C92  12n  C-EU050-025X075  [C050-025X075]
C95  33/6.3  CPOL-EUE2-5  [E2-5]
C96  39n  C-EU050-025X075  [C050-025X075]
C97  1n  C-EU050-025X075  [C050-025X075]
D57  1N4148  [DO35-7C]
D58  1N4148  [DO35-7C]
D82  1N34  1N4148  [DO35-7C]
D83  1N34  1N4148  [DO35-7C]
M7  NC  POT_8089MM  [R0903N]
M8  NC  POT_8089MM  [R0903N]
Q53  2SC945  [TO-92-ECB-PERSO]
Q54  2SA733  [TO-92-ECB-MARKED]
Q55  2SC945  [TO-92-ECB-PERSO]
R239  1K  R-EU_0207/7  [0207/7]
R240  22K  R-EU_0207/7  [0207/7]
R241  10K  R-EU_0207/7  [0207/7]
R242  10K  R-EU_0207/7  [0207/7]
R243  4K7  R-EU_0207/7  [0207/7]
R244  4K7  R-EU_0207/7  [0207/7]
R245  15K  R-EU_0207/7  [0207/7]
R246  3K3  R-EU_0207/7  [0207/7]
R247  2M2  R-EU_0207/7  [0207/7]
R248  33K  R-EU_0207/7  [0207/7]
R249  22K  R-EU_0207/7  [0207/7]
R250  22K  R-EU_0207/7  [0207/7]
R251  4K7  R-EU_0207/7  [0207/7]
R252  4K7  R-EU_0207/7  [0207/7]
R253  2K2  R-EU_0207/7  [0207/7]
R254  6K8  R-EU_0207/7  [0207/7]
R255  22K  R-EU_0207/7  [0207/7]
R256  33K  R-EU_0207/7  [0207/7]
R257  820K  R-EU_0207/7  [0207/7]
R258  33K  R-EU_0207/7  [0207/7]
R259  820K  R-EU_  [0207/7]
R260  1K  R-EU_0207/7  [0207/7]
R261  100K  R-EU_0207/7  [0207/7]
R262  100K  R-EU_0207/7  [0207/7]
R263  47K  R-EU_0207/7  [0207/7]
R266  470K  R-EU_0207/7  [0207/7]
SW9  MSS42_SW_4PDT  [MSS42_SW_SLIDE]
U16  µPC4558CA  [DIL08]
U17  µPC4558CA  [DIL08]
VR12  100KA  POT_8089MM  [R0903N]
VR13  500R  POT_8089MM  [R0903N]

### Nets
+B5 [power]: R252.1 U16.8(V+) U17.8(V+) ; also sheet 4
-B5 [power]: U16.4(V-) U17.4(V-) ; also sheet 4
ACCENT_MT: Q54.E R243.2 ; also sheet 1
GND [GND]: C85.2 C88.2 D58.A M7.P$4(C) M7.P$5(C) M8.P$4(C) M8.P$5(C) Q53.E Q55.E R241.1 R246.2 R249.2 R251.1 R254.1 R263.2 SW9.2A(A:S) SW9.2B(B:S) SW9.P$1(GND) SW9.P$2(GND) SW9.P$3(GND) SW9.P$4(GND) U17.3(A:+IN) VR12.P$4(C) VR12.P$5(C) VR13.3(E) VR13.P$4(C) VR13.P$5(C) ; also sheet 1,2,3,4,5,6,7,8,9,11,12,13,14,15,16,17,18
MT_OUT: J1.4 R239.1
N$108: Q54.B R242.2 R243.1
N$110: Q53.C R242.1
N$112: Q53.B R240.1 R241.2
N$113 [special]: C86.1 Q54.C R244.2 R251.2
N$114: D57.A R244.1
N$115: C86.2 D58.C R255.2
N$116: C90.2 C92.1 D82.A D83.C R259.1 R260.2 SW9.1C(C:O) SW9.1D(D:O)
N$117: C89.2 C90.1 R257.2 U17.6(B:-IN)
N$118: C91.1 C92.2 R257.1 R258.2 U17.7(B:OUT)
N$119: D82.C D83.A VR13.1(A)
N$120: R260.1 VR13.2(S)
N$121: R256.2 R258.1 U17.2(A:-IN)
N$122: R256.1 R259.2 R262.2 U17.1(A:OUT)
N$123: C96.1 R261.1 R262.1
N$124: C96.2 C97.1 R266.2 U16.2(A:-IN) VR12.1(A)
N$125: C95.- VR12.2(S)
N$126: C95.+ C97.2 R239.2 R266.1 U16.1(A:OUT)
N$127: C87.1 Q55.C R252.2
N$128: C88.1 R250.2 SW9.1A(A:O)
N$130: Q55.B R248.2
N$131 [special]: C84.2 R245.2 R246.1
N$132 [special]: C84.1 R247.2 R248.1
N$133: C85.1 D57.C R247.1
N$134: C91.2 SW9.CD(D:P)
N$135 [special]: R261.2 SW9.CA(A:P)
N$136: C87.2 R249.1 R250.1
N$137: R263.1 U16.3(A:+IN)
N$138: R253.1 SW9.CB(B:P)
N$139: R253.2 R254.2 R255.1 U17.5(B:+IN)
N$140: C89.1 SW9.CC(C:P)
PN: R245.1 ; also sheet 6,9,11
TRIG_MT: R240.2 ; also sheet 1
Unconnected: M7.1(A) M7.2(S) M7.3(E) M8.1(A) M8.2(S) M8.3(E) SW9.1B(B:O) SW9.2C(C:S) SW9.2D(D:S) VR12.3(E)

### Notes on the sheet
- MID TOM MID CONGA